# EAGLE board board (EAGLE 7.7.0), part 1 of 3
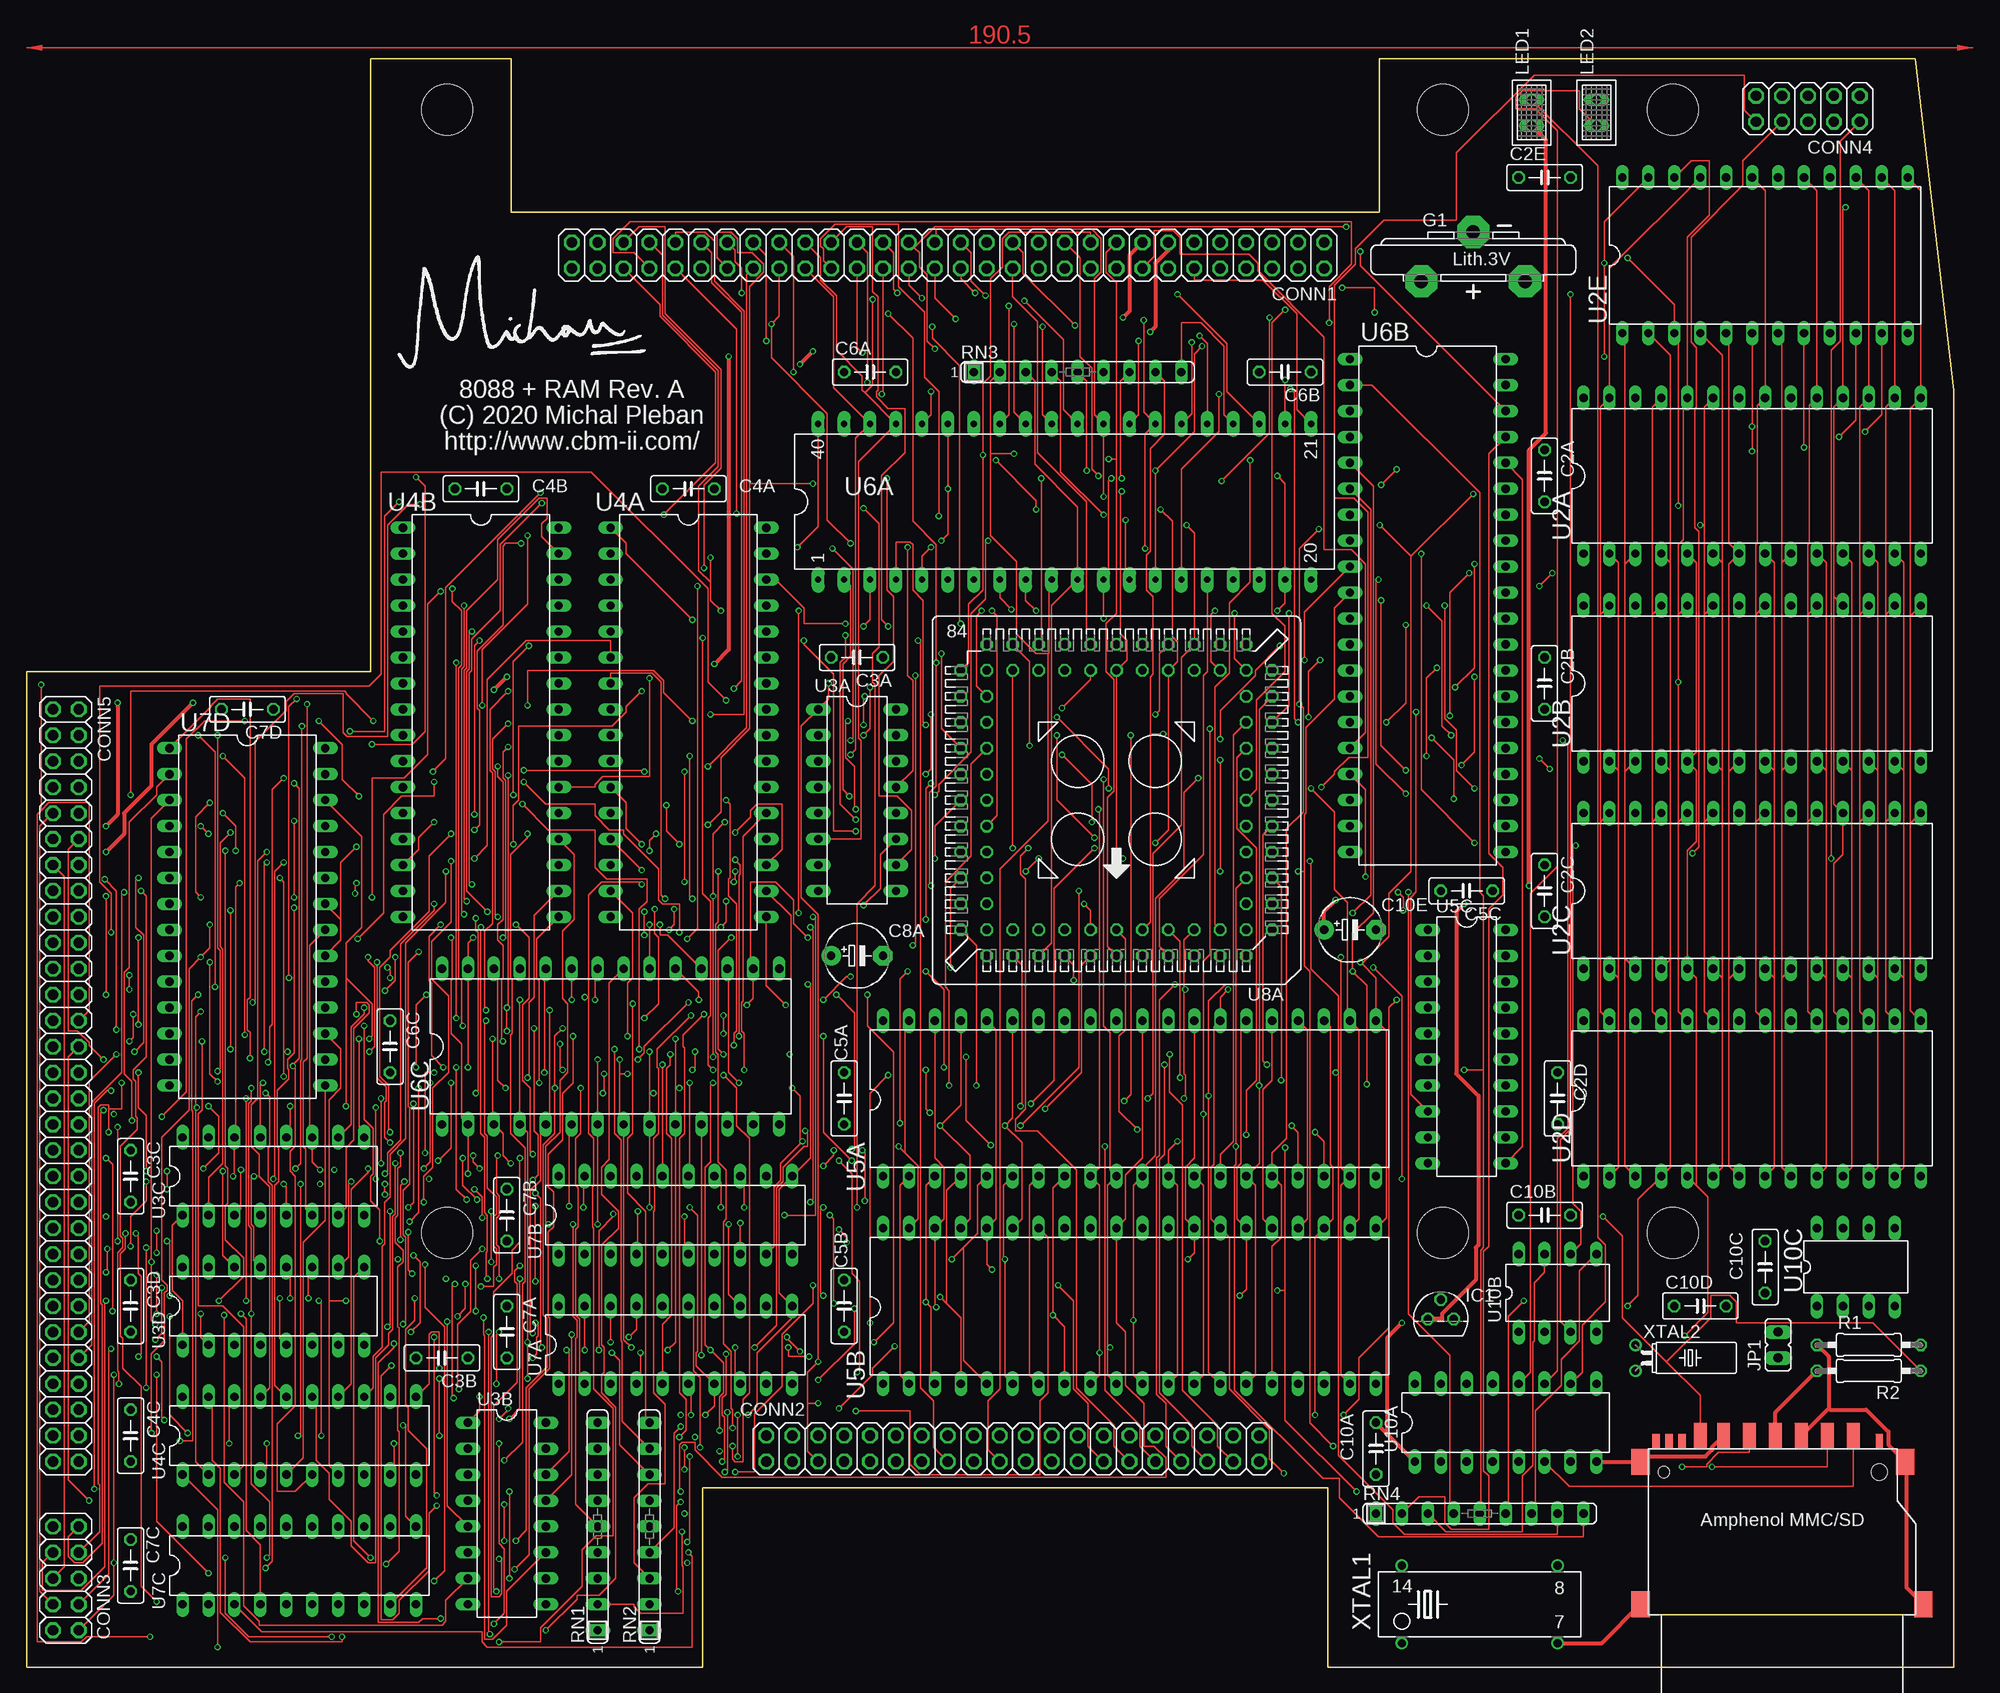
[diagram p10: board, top side]
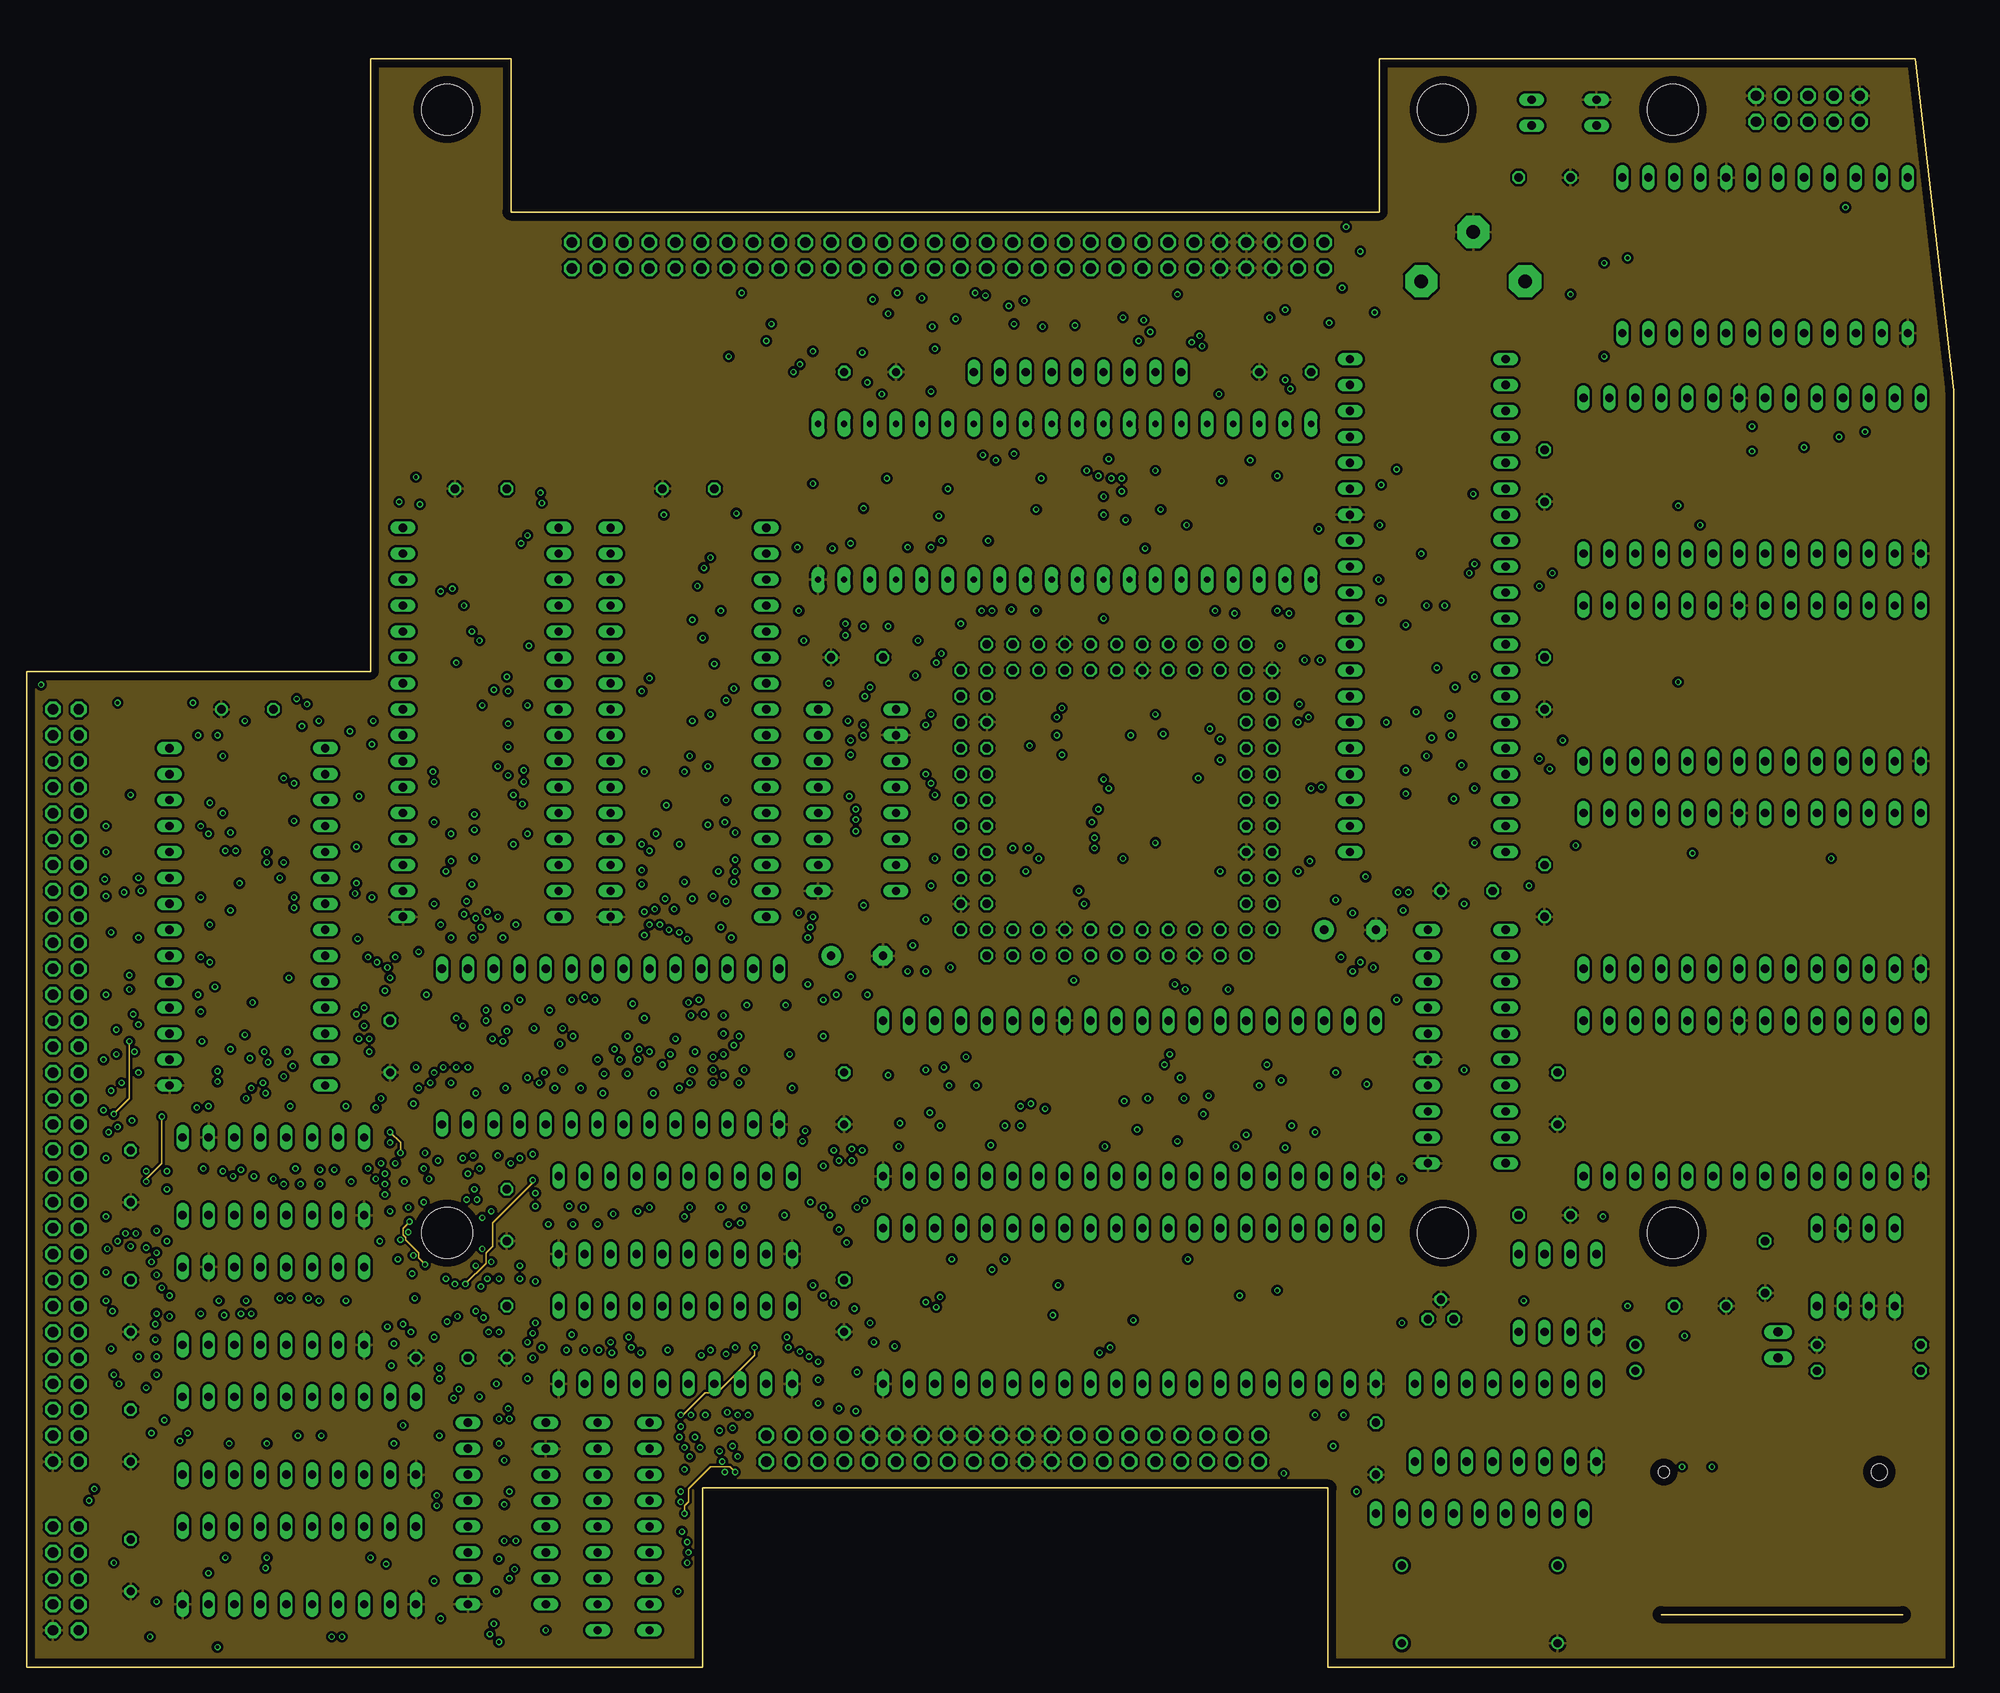
[diagram p11: board, inner layer Route2]
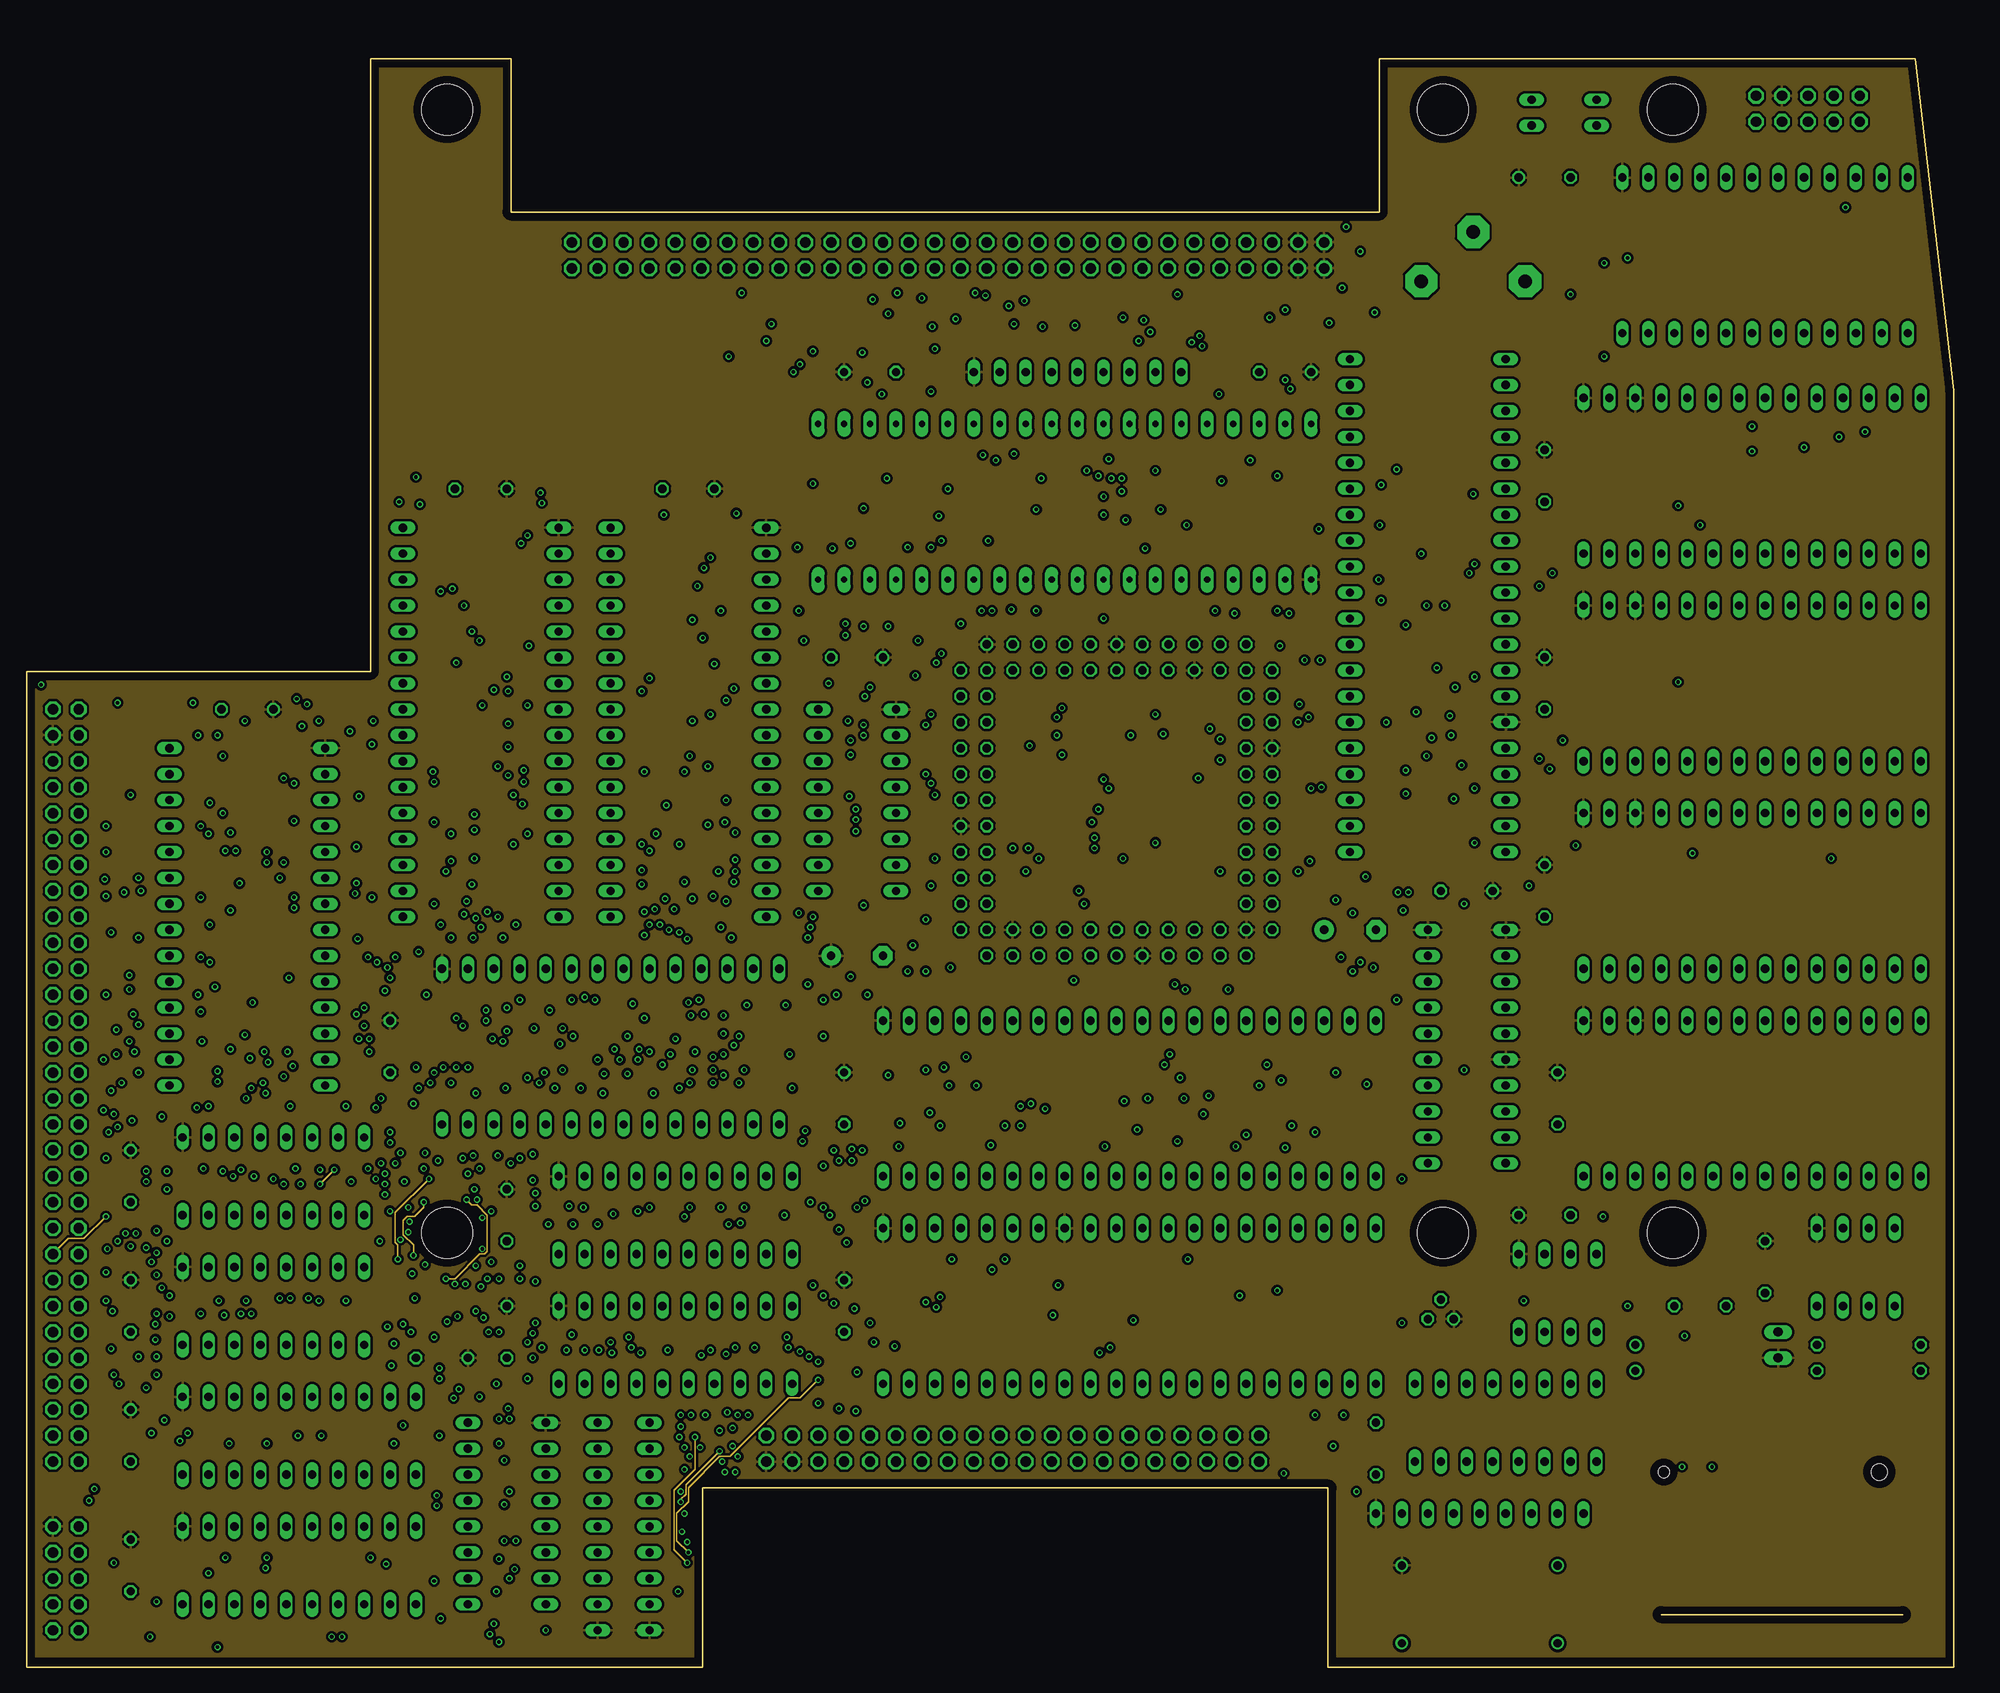
[diagram p12: board, inner layer Route15]
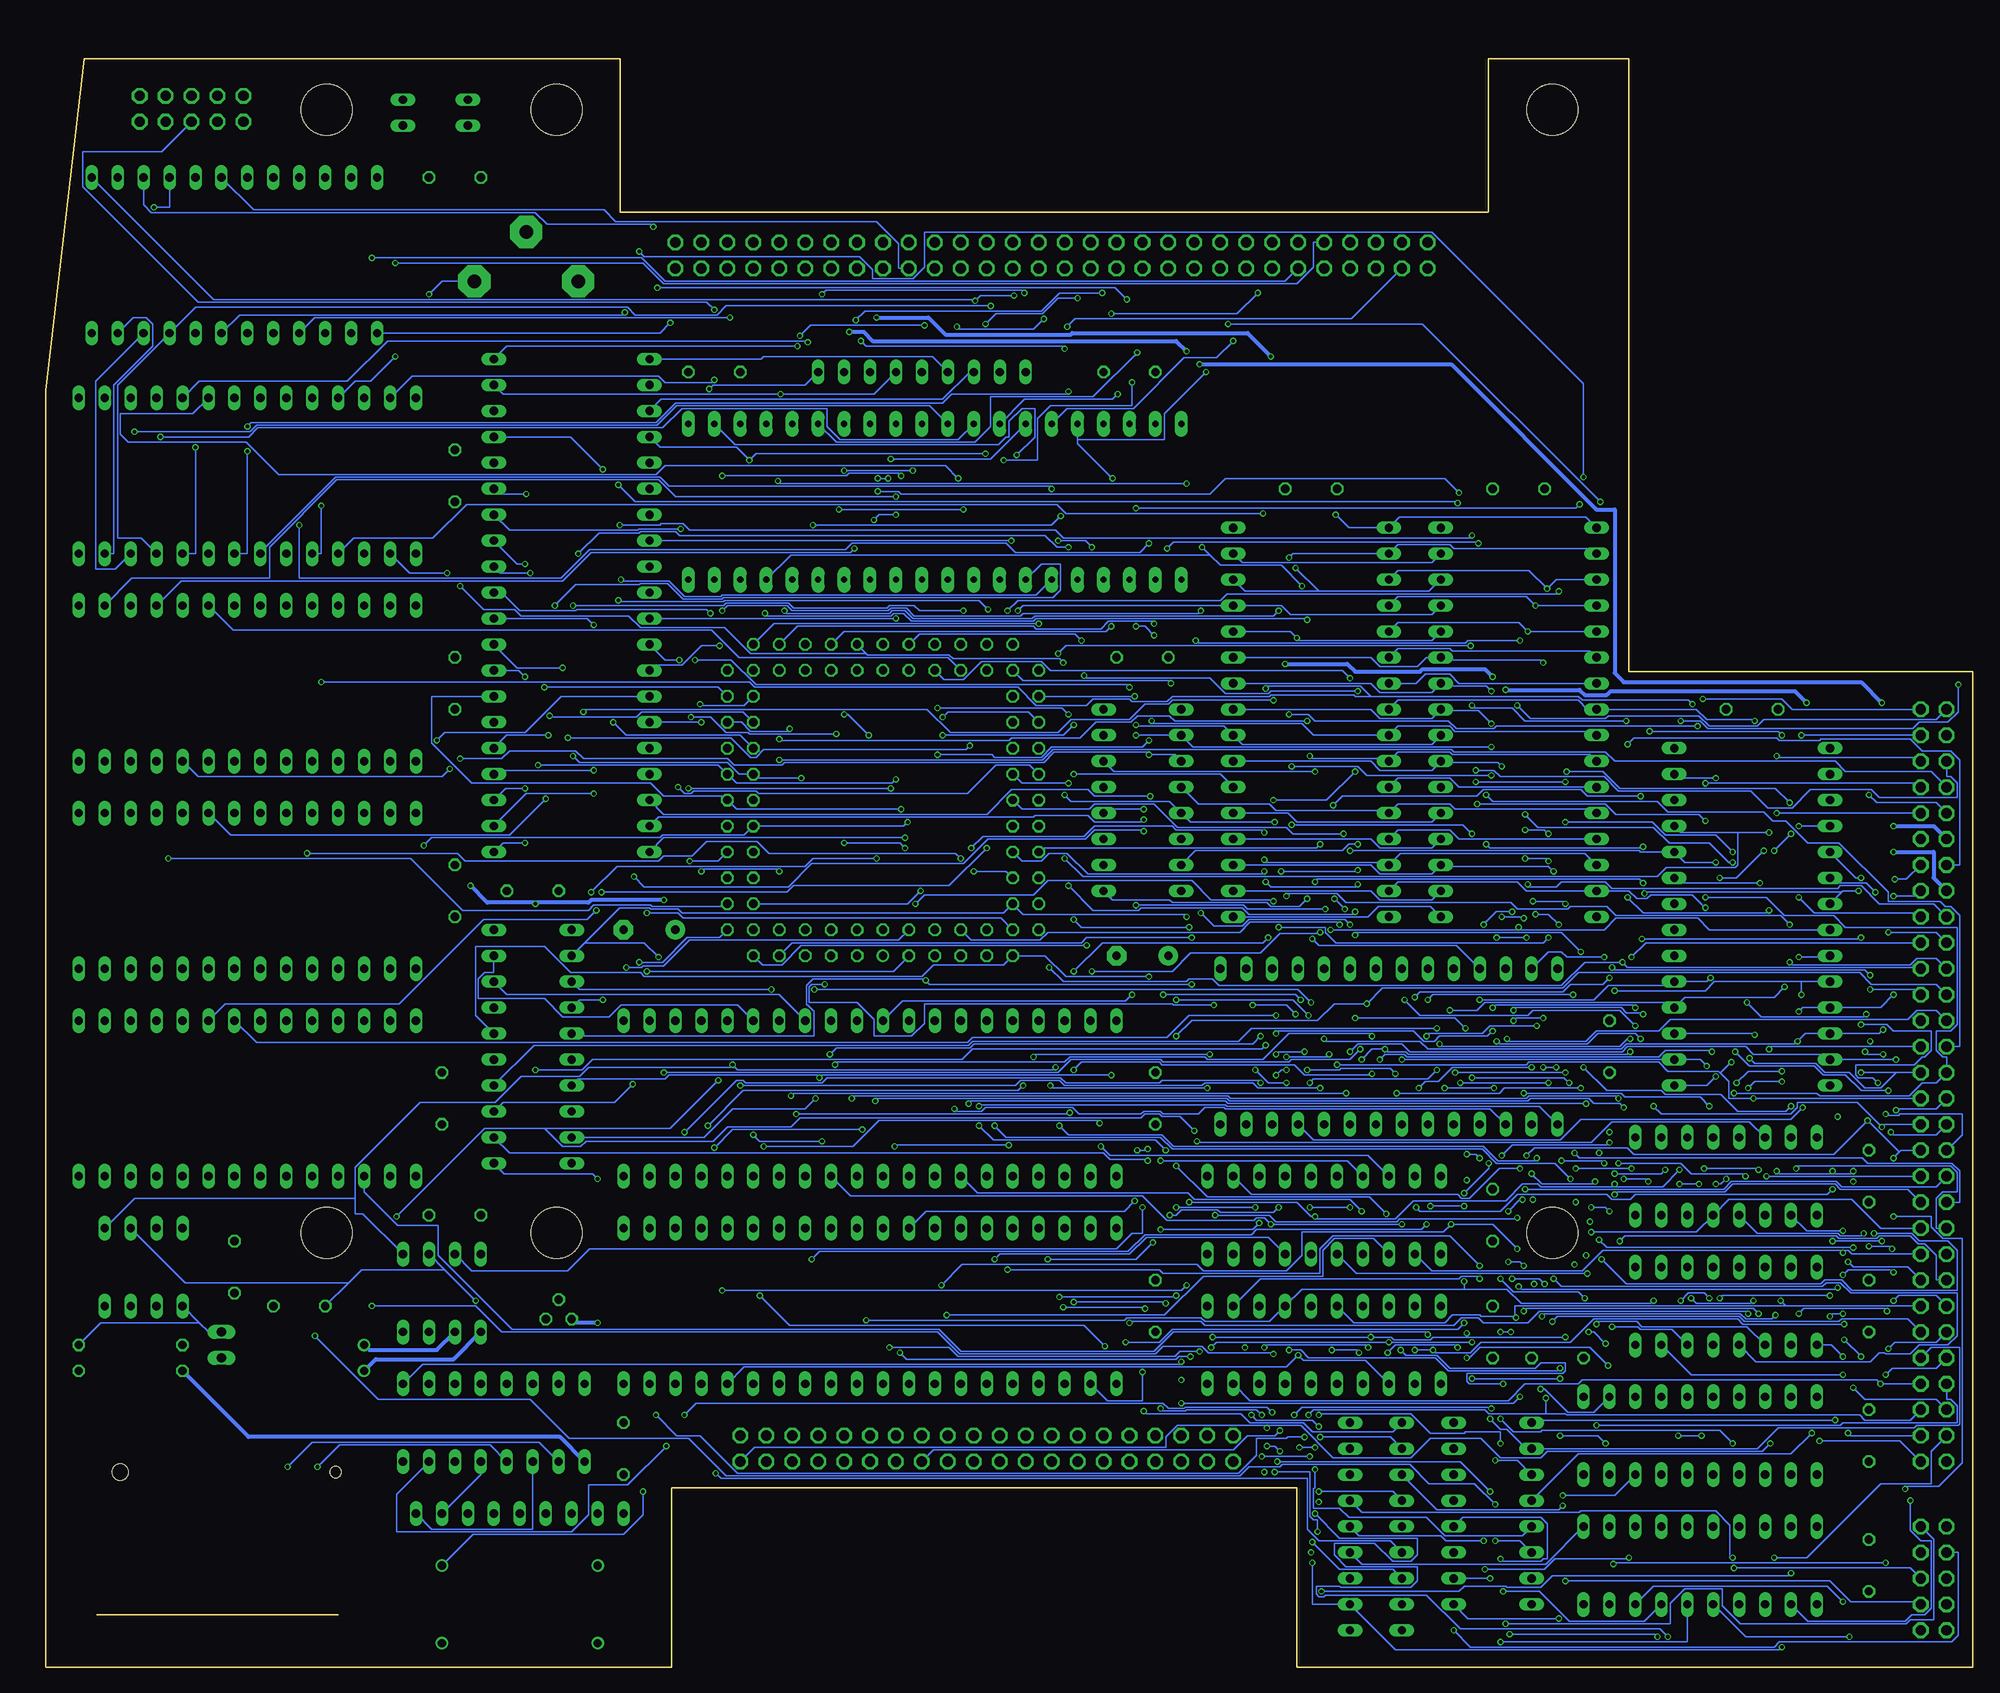
[diagram p13: board, bottom side, seen from below]

Size 188.65 x 157.5 mm. Coordinates in mm from the lower left corner, seen from the top.
Outline: 0,0 0,97.5 33.65,97.5 33.65,157.5 47.4,157.5 47.4,142.46 132.4,142.46 132.4,157.5 184.9,157.5 188.65,125 188.65,0 127.4,0 127.4,17.54 66.15,17.54 66.15,0 0,0
Copper layers (1+2*15+16): Top 0.035mm / dielectric 0.5mm / Route2 0.035mm / dielectric 0.5mm / Route15 0.035mm / dielectric 0.5mm / Bottom 0.035mm
Design rules "default *": minimum track width 5mil, minimum drill 0.35mm, track to track 5mil, track to pad 5mil, pad to pad 10mil, via to via 15mil, smd to smd 5mil, copper to edge 30mil, drill to drill 5mil, minimum pad ring 5mil, minimum via ring 5mil, stop-mask expansion 5mil, vias tented up to drill 0mil, thermal gap 10mil
Net classes: 0 default: width 0.127 mm, drill 0.127 mm, clearance 0.127 mm; 1 power: width 0.381 mm, drill 0.254 mm, clearance 0.254 mm to class 0, clearance 0.254 mm
Holes 5 mm at 41.15,42.5 41.15,152.5 161.15,152.5 138.65,152.5 138.65,42.5 161.15,42.5
tRestrict: area 52.7,130.2 to 52.8,130.2; area 34.3,117.9 to 50.8,139.5; area 38.1,117.9 to 67.3,126.8; area 50.8,126.8 to 61,133.2

## Footprints (pad centres in the part's own frame; a part is rotated, then mirrored left to right if it is on the bottom)
C050-025X075 = drill 0.813 octagon: 1 -2.54,0; 2 2.54,0
E5-6 = drill 0.813 pad 1.905: + -2.54,0 | drill 0.813 pad 1.905 octagon: - 2.54,0
2X30 = drill 1.016 octagon: 1 -38.1,-1.27; 2 -38.1,1.27; 3 -35.56,-1.27; 4 -35.56,1.27; 5 -33.02,-1.27; 6 -33.02,1.27; 7 -30.48,-1.27; 8 -30.48,1.27; 9 -27.94,-1.27; 10 -27.94,1.27; 11 -25.4,-1.27; 12 -25.4,1.27; 13 -22.86,-1.27; 14 -22.86,1.27; 15 -20.32,-1.27; 16 -20.32,1.27; 17 -17.78,-1.27; 18 -17.78,1.27; 19 -15.24,-1.27; 20 -15.24,1.27; 21 -12.7,-1.27; 22 -12.7,1.27; 23 -10.16,-1.27; 24 -10.16,1.27; 25 -7.62,-1.27; 26 -7.62,1.27; 27 -5.08,-1.27; 28 -5.08,1.27; 29 -2.54,-1.27; 30 -2.54,1.27; 31 0,-1.27; 32 0,1.27; 33 2.54,-1.27; 34 2.54,1.27; 35 5.08,-1.27; 36 5.08,1.27; 37 7.62,-1.27; 38 7.62,1.27; 39 10.16,-1.27; 40 10.16,1.27; 41 12.7,-1.27; 42 12.7,1.27; 43 15.24,-1.27; 44 15.24,1.27; 45 17.78,-1.27; 46 17.78,1.27; 47 20.32,-1.27; 48 20.32,1.27; 49 22.86,-1.27; 50 22.86,1.27; 51 25.4,-1.27; 52 25.4,1.27; 53 27.94,-1.27; 54 27.94,1.27; 55 30.48,-1.27; 56 30.48,1.27; 57 33.02,-1.27; 58 33.02,1.27; 59 35.56,-1.27; 60 35.56,1.27
2X20 = drill 1.016 octagon: 1 -24.13,-1.27; 2 -24.13,1.27; 3 -21.59,-1.27; 4 -21.59,1.27; 5 -19.05,-1.27; 6 -19.05,1.27; 7 -16.51,-1.27; 8 -16.51,1.27; 9 -13.97,-1.27; 10 -13.97,1.27; 11 -11.43,-1.27; 12 -11.43,1.27; 13 -8.89,-1.27; 14 -8.89,1.27; 15 -6.35,-1.27; 16 -6.35,1.27; 17 -3.81,-1.27; 18 -3.81,1.27; 19 -1.27,-1.27; 20 -1.27,1.27; 21 1.27,-1.27; 22 1.27,1.27; 23 3.81,-1.27; 24 3.81,1.27; 25 6.35,-1.27; 26 6.35,1.27; 27 8.89,-1.27; 28 8.89,1.27; 29 11.43,-1.27; 30 11.43,1.27; 31 13.97,-1.27; 32 13.97,1.27; 33 16.51,-1.27; 34 16.51,1.27; 35 19.05,-1.27; 36 19.05,1.27; 37 21.59,-1.27; 38 21.59,1.27; 39 24.13,-1.27; 40 24.13,1.27
2X05 = drill 1.016 octagon: 1 -5.08,-1.27; 2 -5.08,1.27; 3 -2.54,-1.27; 4 -2.54,1.27; 5 0,-1.27; 6 0,1.27; 7 2.54,-1.27; 8 2.54,1.27; 9 5.08,-1.27; 10 5.08,1.27
CR2032V = drill 1.321 pad 3.15 octagon: + -2.54,-5.08; +@1 -2.54,5.08; - 2.286,0
TO92 = drill 0.813 octagon: 1 -1.27,0; 2 0,1.905; 3 1.27,0
SDCMF-10915W010 = smd 1.27 x 2.54: 1 7.366,13.97; 2 4.826,13.97; 3 2.286,13.97; 4 -0.254,13.97; 5 -2.794,13.97; 6 -5.334,13.97; 7 -7.62,13.97 | smd 0.711 x 1.422: 8 -9.398,13.462; 9 9.906,13.462; 10 -11.938,13.462; 11 -10.668,13.462 | smd 1.778 x 2.54: M1 12.446,11.43; M2 14.224,-2.54; M3 -13.462,-2.54; M4 -13.462,11.43 | hole 1.6: 9.906,10.414 | hole 1.1: -11.176,10.414
JP1 = drill 0.914 long: 1 0,-1.27; 2 0,1.27
U57X32 = drill 0.813 long: A -1.27,0; K 1.27,0
0207/10 = drill 0.813 octagon: 1 -5.08,0; 2 5.08,0
SIL9 = drill 0.813 long: 1 -10.16,0; 2 -7.62,0; 3 -5.08,0; 4 -2.54,0; 5 0,0; 6 2.54,0; 7 5.08,0; 8 7.62,0; 9 10.16,0
DIL28-6 = drill 0.813 long: 1 -16.51,-7.62; 2 -13.97,-7.62; 3 -11.43,-7.62; 4 -8.89,-7.62; 5 -6.35,-7.62; 6 -3.81,-7.62; 7 -1.27,-7.62; 8 1.27,-7.62; 9 3.81,-7.62; 10 6.35,-7.62; 11 8.89,-7.62; 12 11.43,-7.62; 13 13.97,-7.62; 14 16.51,-7.62; 15 16.51,7.62; 16 13.97,7.62; 17 11.43,7.62; 18 8.89,7.62; 19 6.35,7.62; 20 3.81,7.62; 21 1.27,7.62; 22 -1.27,7.62; 23 -3.81,7.62; 24 -6.35,7.62; 25 -8.89,7.62; 26 -11.43,7.62; 27 -13.97,7.62; 28 -16.51,7.62
DIL24 = drill 0.813 long: 1 -13.97,-7.62; 2 -11.43,-7.62; 3 -8.89,-7.62; 4 -6.35,-7.62; 5 -3.81,-7.62; 6 -1.27,-7.62; 7 1.27,-7.62; 8 3.81,-7.62; 9 6.35,-7.62; 10 8.89,-7.62; 11 11.43,-7.62; 12 13.97,-7.62; 13 13.97,7.62; 14 11.43,7.62; 15 8.89,7.62; 16 6.35,7.62; 17 3.81,7.62; 18 1.27,7.62; 19 -1.27,7.62; 20 -3.81,7.62; 21 -6.35,7.62; 22 -8.89,7.62; 23 -11.43,7.62; 24 -13.97,7.62
DIL16 = drill 0.813 long: 1 -8.89,-3.81; 2 -6.35,-3.81; 3 -3.81,-3.81; 4 -1.27,-3.81; 5 1.27,-3.81; 6 3.81,-3.81; 7 6.35,-3.81; 8 8.89,-3.81; 9 8.89,3.81; 10 6.35,3.81; 11 3.81,3.81; 12 1.27,3.81; 13 -1.27,3.81; 14 -3.81,3.81; 15 -6.35,3.81; 16 -8.89,3.81
DIL32 = drill 0.813 long: 1 -17.78,-7.62; 2 -15.24,-7.62; 3 -12.7,-7.62; 4 -10.16,-7.62; 5 -7.62,-7.62; 6 -5.08,-7.62; 7 -2.54,-7.62; 8 0,-7.62; 9 2.54,-7.62; 10 5.08,-7.62; 11 7.62,-7.62; 12 10.16,-7.62; 13 12.7,-7.62; 14 15.24,-7.62; 15 17.78,-7.62; 16 20.32,-7.62; 17 20.32,7.62; 18 17.78,7.62; 19 15.24,7.62; 20 12.7,7.62; 21 10.16,7.62; 22 7.62,7.62; 23 5.08,7.62; 24 2.54,7.62; 25 0,7.62; 26 -2.54,7.62; 27 -5.08,7.62; 28 -7.62,7.62; 29 -10.16,7.62; 30 -12.7,7.62; 31 -15.24,7.62; 32 -17.78,7.62
DIL20 = drill 0.813 long: 1 -11.43,-3.81; 2 -8.89,-3.81; 3 -6.35,-3.81; 4 -3.81,-3.81; 5 -1.27,-3.81; 6 1.27,-3.81; 7 3.81,-3.81; 8 6.35,-3.81; 9 8.89,-3.81; 10 11.43,-3.81; 11 11.43,3.81; 12 8.89,3.81; 13 6.35,3.81; 14 3.81,3.81; 15 1.27,3.81; 16 -1.27,3.81; 17 -3.81,3.81; 18 -6.35,3.81; 19 -8.89,3.81; 20 -11.43,3.81
DIL40 = drill 0.813 long: 1 -24.13,-7.62; 2 -21.59,-7.62; 3 -19.05,-7.62; 4 -16.51,-7.62; 5 -13.97,-7.62; 6 -11.43,-7.62; 7 -8.89,-7.62; 8 -6.35,-7.62; 9 -3.81,-7.62; 10 -1.27,-7.62; 11 1.27,-7.62; 12 3.81,-7.62; 13 6.35,-7.62; 14 8.89,-7.62; 15 11.43,-7.62; 16 13.97,-7.62; 17 16.51,-7.62; 18 19.05,-7.62; 19 21.59,-7.62; 20 24.13,-7.62; 21 24.13,7.62; 22 21.59,7.62; 23 19.05,7.62; 24 16.51,7.62; 25 13.97,7.62; 26 11.43,7.62; 27 8.89,7.62; 28 6.35,7.62; 29 3.81,7.62; 30 1.27,7.62; 31 -1.27,7.62; 32 -3.81,7.62; 33 -6.35,7.62; 34 -8.89,7.62; 35 -11.43,7.62; 36 -13.97,7.62; 37 -16.51,7.62; 38 -19.05,7.62; 39 -21.59,7.62; 40 -24.13,7.62
DIP40 = drill 0.61 pad 1.27 long: 1 -24.13,-7.62; 2 -21.59,-7.62; 3 -19.05,-7.62; 4 -16.51,-7.62; 5 -13.97,-7.62; 6 -11.43,-7.62; 7 -8.89,-7.62; 8 -6.35,-7.62; 9 -3.81,-7.62; 10 -1.27,-7.62; 11 1.27,-7.62; 12 3.81,-7.62; 13 6.35,-7.62; 14 8.89,-7.62; 15 11.43,-7.62; 16 13.97,-7.62; 17 16.51,-7.62; 18 19.05,-7.62; 19 21.59,-7.62; 20 24.13,-7.62; 21 24.13,7.62; 22 21.59,7.62; 23 19.05,7.62; 24 16.51,7.62; 25 13.97,7.62; 26 11.43,7.62; 27 8.89,7.62; 28 6.35,7.62; 29 3.81,7.62; 30 1.27,7.62; 31 -1.27,7.62; 32 -3.81,7.62; 33 -6.35,7.62; 34 -8.89,7.62; 35 -11.43,7.62; 36 -13.97,7.62; 37 -16.51,7.62; 38 -19.05,7.62; 39 -21.59,7.62; 40 -24.13,7.62
DIL28 = drill 0.813 long: 1 -16.51,-7.62; 2 -13.97,-7.62; 3 -11.43,-7.62; 4 -8.89,-7.62; 5 -6.35,-7.62; 6 -3.81,-7.62; 7 -1.27,-7.62; 8 1.27,-7.62; 9 3.81,-7.62; 10 6.35,-7.62; 11 8.89,-7.62; 12 11.43,-7.62; 13 13.97,-7.62; 14 16.51,-7.62; 15 16.51,7.62; 16 13.97,7.62; 17 11.43,7.62; 18 8.89,7.62; 19 6.35,7.62; 20 3.81,7.62; 21 1.27,7.62; 22 -1.27,7.62; 23 -3.81,7.62; 24 -6.35,7.62; 25 -8.89,7.62; 26 -11.43,7.62; 27 -13.97,7.62; 28 -16.51,7.62
S84 = drill 0.813: 1 0,15.24 | drill 0.813 octagon: 2 0,12.7; 3 -2.54,15.24; 4 -2.54,12.7; 5 -5.08,15.24; 6 -5.08,12.7; 7 -7.62,15.24; 8 -7.62,12.7; 9 -10.16,15.24; 10 -10.16,12.7; 11 -12.7,15.24; 12 -15.24,12.7; 13 -12.7,12.7; 14 -15.24,10.16; 15 -12.7,10.16; 16 -15.24,7.62; 17 -12.7,7.62; 18 -15.24,5.08; 19 -12.7,5.08; 20 -15.24,2.54; 21 -12.7,2.54; 22 -15.24,0; 23 -12.7,0; 24 -15.24,-2.54; 25 -12.7,-2.54; 26 -15.24,-5.08; 27 -12.7,-5.08; 28 -15.24,-7.62; 29 -12.7,-7.62; 30 -15.24,-10.16; 31 -12.7,-10.16; 32 -15.24,-12.7; 33 -12.7,-15.24; 34 -12.7,-12.7; 35 -10.16,-15.24; 36 -10.16,-12.7; 37 -7.62,-15.24; 38 -7.62,-12.7; 39 -5.08,-15.24; 40 -5.08,-12.7; 41 -2.54,-15.24; 42 -2.54,-12.7; 43 0,-15.24; 44 0,-12.7; 45 2.54,-15.24; 46 2.54,-12.7; 47 5.08,-15.24; 48 5.08,-12.7; 49 7.62,-15.24; 50 7.62,-12.7; 51 10.16,-15.24; 52 10.16,-12.7; 53 12.7,-15.24; 54 15.24,-12.7; 55 12.7,-12.7; 56 15.24,-10.16; 57 12.7,-10.16; 58 15.24,-7.62; 59 12.7,-7.62; 60 15.24,-5.08; 61 12.7,-5.08; 62 15.24,-2.54; 63 12.7,-2.54; 64 15.24,0; 65 12.7,0; 66 15.24,2.54; 67 12.7,2.54; 68 15.24,5.08; 69 12.7,5.08; 70 15.24,7.62; 71 12.7,7.62; 72 15.24,10.16; 73 12.7,10.16; 74 15.24,12.7; 75 12.7,15.24; 76 12.7,12.7; 77 10.16,15.24; 78 10.16,12.7; 79 7.62,15.24; 80 7.62,12.7; 81 5.08,15.24; 82 5.08,12.7; 83 2.54,15.24; 84 2.54,12.7
DIL08 = drill 0.813 long: 1 -3.81,-3.81; 2 -1.27,-3.81; 3 1.27,-3.81; 4 3.81,-3.81; 5 3.81,3.81; 6 1.27,3.81; 7 -1.27,3.81; 8 -3.81,3.81
DIL8 = drill 0.813 long: 1 -3.81,-3.81; 2 -1.27,-3.81; 3 1.27,-3.81; 4 3.81,-3.81; 5 3.81,3.81; 6 1.27,3.81; 7 -1.27,3.81; 8 -3.81,3.81
SG51 = drill 0.813: 1 -7.62,-3.81; 7 7.62,-3.81; 8 7.62,3.81; 14 -7.62,3.81
TC38H = drill 0.813: 1 -1.27,0; 2 1.27,0

## Placement (x,y rotation side)
C2A  100n  [C050-025X075]  148.59,116.64 270 top
C2B  100n  [C050-025X075]  148.59,96.32 270 top
C2C  100n  [C050-025X075]  148.59,76 270 top
C2D  100n  [C050-025X075]  149.86,55.68 270 top
C2E  100n  [C050-025X075]  148.59,145.85 0 top
C3A  100n  [C050-025X075]  81.28,98.86 180 top
C3B  100n  [C050-025X075]  40.64,30.28 180 top
C3C  100n  [C050-025X075]  10.16,48.06 270 top
C3D  100n  [C050-025X075]  10.16,35.36 270 top
C4A  100n  [C050-025X075]  64.77,115.37 180 top
C4B  100n  [C050-025X075]  44.45,115.37 180 top
C4C  100n  [C050-025X075]  10.16,22.66 270 top
C5A  100n  [C050-025X075]  80.01,55.68 270 top
C5B  100n  [C050-025X075]  80.01,35.36 270 top
C5C  100n  [C050-025X075]  140.97,76 180 top
C6A  100n  [C050-025X075]  82.55,126.8 0 top
C6B  100n  [C050-025X075]  123.19,126.8 180 top
C6C  100n  [C050-025X075]  35.56,60.76 270 top
C7A  100n  [C050-025X075]  46.99,32.82 270 top
C7B  100n  [C050-025X075]  46.99,44.25 270 top
C7C  100n  [C050-025X075]  10.16,9.96 270 top
C7D  100n  [C050-025X075]  21.59,93.78 180 top
C8A  25u  [E5-6]  81.28,69.65 0 top
C10A  100n  [C050-025X075]  132.08,21.39 270 top
C10B  100n  [C050-025X075]  148.59,44.25 0 top
C10C  100n  [C050-025X075]  170.18,39.17 270 top
C10D  100n  [C050-025X075]  163.83,35.36 0 top
C10E  25u  [E5-6]  129.54,72.19 0 top
CONN1  MAINBOARD  [2X30]  88.9,138.23 180 top
CONN2  DRAM  [2X20]  96.52,21.39 180 top
CONN3  I/O  [2X05]  3.81,8.69 270 top
CONN4  JTAG  [2X05]  174.37,152.58 180 top
CONN5  ISA  [2X30]  3.81,55.68 270 top
G1  CR2032V  [CR2032V]  141.61,138.23 90 top
IC1  LP2950Z  [TO92]  138.43,34.09 0 top
J1  [SDCMF-10915W010]  171.45,8.69 0 top
JP1  [JP1]  171.45,31.55 0 top
LED1  [U57X32]  147.32,152.2 90 top
LED2  [U57X32]  153.67,152.2 90 top
R1  4.7k  [0207/10]  180.34,31.55 0 top
R2  4.7k  [0207/10]  180.34,29.01 180 top
RN1  [SIL9]  55.88,13.77 90 top
RN2  [SIL9]  60.96,13.77 90 top
RN3  [SIL9]  102.87,126.8 0 top
RN4  [SIL9]  142.24,15.04 0 top
U2A  [DIL28-6]  168.91,116.64 0 top
U2B  [DIL28-6]  168.91,96.32 0 top
U2C  [DIL28-6]  168.91,76 0 top
U2D  [DIL28-6]  168.91,55.68 0 top
U2E  6116  [DIL24]  170.18,138.23 0 top
U3A  74LS257N  [DIL16]  81.28,84.89 270 top
U3B  74LS257N  [DIL16]  46.99,15.04 270 top
U3C  74LS257N  [DIL16]  24.13,48.06 0 top
U3D  74LS257N  [DIL16]  24.13,35.36 0 top
U4A  HM628512A_DIL32  [DIL32]  64.77,93.78 270 top
U4B  HM628512A_DIL32  [DIL32]  44.45,93.78 270 top
U4C  74LS245N  [DIL20]  26.67,22.66 0 top
U5A  8088MAX  [DIL40]  107.95,55.68 0 top
U5B  8087  [DIL40]  107.95,35.36 0 top
U5C  8288-A  [DIL20]  140.97,60.76 270 top
U6A  6526  [DIP40]  101.6,114.1 0 top
U6B  8255  [DIL40]  137.16,103.94 270 top
U6C  8259  [DIL28-6]  57.15,60.76 0 top
U7A  74LS373N  [DIL20]  63.5,31.55 0 top
U7B  74LS373N  [DIL20]  63.5,44.25 0 top
U7C  74HC373N  [DIL20]  26.67,9.96 0 top
U7D  27512  [DIL28]  21.59,73.46 270 top
U8A  ATF1508-JU84  [S84]  106.68,84.89 180 top
U10A  4050N  [DIL16]  144.78,23.93 0 top
U10B  DS1307  [DIL08]  149.86,36.63 0 top
U10C  24C64P  [DIL8]  179.07,39.17 0 top
XTAL1  24MHz  [SG51]  142.24,6.15 0 top
XTAL2  [TC38H]  157.48,30.28 270 top

## Tracks (layer width: path | path; a pad name or v marks a point on that pad's centre or on a via)
+3V3  (via drill 0.35)
  Top 0.381: R2.2 171.2,24.95 J1.4 | U10A.1 133.1,22.91 | 133.1,22.91 C10A.1 | v134.62,33.71 133.22,32.31 133.22,23.04 133.1,22.91 | LED1.A 148.72,149.53 148.72,120.83 147.07,119.18 v147.07,76.51 | v128.14,75.11 127,73.97 C10E.+ | IC1.1 138.56,34.09 138.56,34.6 141.86,37.9 141.86,41.08 142.11,41.33 142.11,55.93 139.95,58.09 139.95,73.97 v140.72,74.73
  Bottom 0.381: IC1.1 136.78,33.71 v134.62,33.71 | R2.2 168.78,22.53 138.3,22.53 U10A.1 | v147.07,76.51 145.41,74.86 140.72,74.86 | 140.72,74.86 135.51,74.86 135.25,75.11 v128.14,75.11 | v140.72,74.73 140.72,74.86
+12V  (via drill 0.35)
  Top 0.381: v7.75,79.81 9.53,81.59 9.53,83.62 12.19,86.29 12.19,90.35 v16.26,94.42 | v46.99,96.95 v45.72,95.69 | v67.31,98.22 68.71,99.62 v68.71,128.32 | v107.32,132.13 107.95,132.77 107.95,138.23 CONN1.15
  Bottom 0.381: CONN5.15 3.81,77.27 3.81,79.81 v7.75,79.81 | v16.26,94.42 17.4,95.56 35.43,95.56 35.81,95.18 37.97,95.18 38.48,95.69 v45.72,95.69 | v46.99,96.95 47.75,97.72 53.85,97.72 54.1,97.46 60.45,97.46 61.21,98.22 v67.31,98.22 | v68.71,128.32 70.99,130.61 88.14,130.61 88.27,130.48 100.58,130.48 102.23,132.13 v107.32,132.13
-12V  (via drill 0.35)
  Top 0.381: v7.75,82.35 8.89,83.49 v8.89,94.42 | v76.96,128.83 v75.69,127.56 | v109.98,130.74 110.49,131.25 110.49,137.47 111.76,138.74 CONN1.13
  Bottom 0.381: CONN5.11 3.81,82.35 v7.75,82.35 | v8.89,94.42 10.92,96.45 34.16,96.45 35.05,97.34 35.05,113.34 36.83,113.34 51.05,127.56 v75.69,127.56 | v76.96,128.83 77.98,129.85 107.7,129.85 108.59,130.74 v109.98,130.74
/AIOWC  (via drill 0.35)
  Top 0.127: RN2.9 60.58,24.31 60.58,44.63 58.8,46.41 58.8,51.74 59.31,52.25 v59.31,64.95 | v80.77,49.58 77.98,52.38 v77.98,61.78
  Bottom 0.127: CONN5.23 3.56,66.86 9.91,66.86 11.05,68 38.61,68 40.13,66.47 57.79,66.47 v59.31,64.95 62.48,64.95 64.14,63.3 76.45,63.3 v77.98,61.78 | U5C.12 143.26,50.35 85.09,50.35 84.46,49.71 80.9,49.71 v80.77,49.58
/AMWC  (via drill 0.35)
  Top 0.127: U5C.8 135.51,56.06 135.51,75.37 136.02,75.87 v136.02,93.53 | v68.45,94.67 66.68,96.45 66.68,105.59 55.24,117.02 34.67,117.02 34.67,97.21 33.53,96.07 7.11,96.07 7.11,76.89 8.26,75.75 v8.26,71.94
  Bottom 0.127: v136.02,93.53 135.76,93.78 102.36,93.78 100.08,91.49 89.54,91.49 88.27,92.76 82.55,92.76 81.03,94.29 78.74,94.29 78.36,94.67 v68.45,94.67 | v8.26,71.94 3.56,71.94 CONN5.19
/BUSY1  (via drill 0.35)
  Top 0.127: U8A.10 116.33,72.7 116.33,95.94 117.73,97.34 117.73,104.19 119.76,106.23 v119.76,118.16 | RN3.2 94.36,125.91 94.36,118.8 | 94.36,118.8 94.36,110.8 96.9,108.26 96.9,101.15 98.81,99.24 99.95,99.24 | 99.95,99.24 100.08,99.24 100.08,106.23 U6A.10 | CONN2.22 94.11,21.26 94.11,26.09 95.25,27.23 95.25,78.16 99.95,82.86 99.95,99.24 | 94.36,118.8 v96.65,118.8
  Bottom 0.127: U6B.4 128.52,119.43 121.03,119.43 v119.76,118.16 119.13,118.8 v96.65,118.8
/BUSY2  (via drill 0.35)
  Top 0.127: v13.46,24.18 13.21,24.44 13.21,29.9 v12.7,30.41 | U3C.1 14.22,43.23 14.22,36.88 15.24,35.87 U3D.1 | v78.49,96.32 78.49,94.8 U3A.1 75.82,92.13 75.82,75.37 77.47,73.71 v77.47,29.9 76.45,28.88 76.45,25.84 | 76.45,25.84 76.45,21.14 CONN2.36 | U3B.1 44.32,25.07 v44.32,26.47 | 76.45,25.84 v77.47,25.84
  Bottom 0.127: U3B.1 42.93,24.18 v13.46,24.18 | v12.7,30.41 13.84,31.55 U3D.1 | v78.49,96.32 78.74,96.57 92.96,96.57 U8A.55 | U10A.9 151.77,29.64 77.72,29.64 v77.47,29.9 | v44.32,26.47 44.96,25.84 v77.47,25.84
/CAS  (via drill 0.35)
  Top 0.127: U8A.45 103.76,100.51 103.76,114.1 98.93,118.93 98.93,131.75 96.52,134.17 CONN1.26 | CONN2.26 88.77,21.52 88.77,26.09 87.5,27.36 87.5,100.26 v87.25,100.51
  Bottom 0.127: v87.25,100.51 87.88,101.15 103.12,101.15 U8A.45
/CS_8255  (via drill 0.35)
  Top 0.127: v129.79,73.84 131.57,75.62 131.57,113.34 U6B.6
  Bottom 0.127: U8A.76 95.12,73.33 126.24,73.33 126.75,73.84 v129.79,73.84
/CS_8259  (via drill 0.35)
  Top 0.127: v97.28,54.92 97.41,55.05 97.41,68.76 U8A.77
  Bottom 0.127: U6C.1 42.42,54.92 73.03,54.92 73.15,55.05 97.16,55.05 v97.28,54.92
/EPROM  (via drill 0.35)
  Top 0.127: U7D.20 30.73,71.17 30.73,73.21 | U7D.22 30.73,73.21 | v86.74,70.67 87,70.92 v87,97.08 | v60.2,95.56 58.67,94.03 58.67,93.53 57.28,92.13 48.13,92.13 48.13,84.89 47.62,84.38 v47.62,80.57 | v32.26,80.32 30.73,78.79 30.73,73.21
  Bottom 0.127: U8A.11 118.49,68.76 116.59,68.76 114.68,70.67 v86.74,70.67 | v87,97.08 86.74,96.83 74.68,96.83 73.15,95.3 68.96,95.3 68.71,95.56 v60.2,95.56 | v47.62,80.57 47.24,80.19 32.38,80.19 v32.26,80.32
/EPROM1  (via drill 0.35)
  Top 0.127: U8A.49 99.31,100.38 v99.31,116.39
  Bottom 0.127: v99.31,116.39 100.58,117.66 128.02,117.66 128.91,116.77 165.86,116.77 169.04,119.94 180.59,119.94 181.36,120.7 181.36,122.74 174.24,122.74 U2A.20
/EPROM2
  Bottom 0.127: U8A.50 100.33,98.86 120.78,98.86 123.44,101.53 170.31,101.53 U2B.20
/EPROM3  (via drill 0.35)
  Top 0.127: U8A.51 98.17,98.48 v98.17,90.22 | v137.54,90.99 139.7,88.83 v139.7,85.02
  Bottom 0.127: v98.17,90.22 98.55,89.84 118.36,89.84 119.13,89.08 119.63,89.08 121.54,90.99 v137.54,90.99 | v139.7,85.02 143.26,81.46 170.56,81.46 U2C.20
/EPROM4  (via drill 0.35)
  Top 0.127: v96.52,80.19 U8A.52 | v134.24,75.87 134.75,75.37 v134.75,74.09
  Bottom 0.127: v96.52,80.19 100.2,76.51 115.44,76.51 116.08,75.87 v134.24,75.87 | v134.75,74.09 135.64,73.21 145.8,73.21 154.05,64.95 171.07,64.95 U2D.20
/EXTBUFCS
  Bottom 0.127: U2E.18 168.28,142.68 133.99,142.68 132.84,141.53 107.32,141.53 105.16,139.37 105.16,136.96 CONN1.20
/EXTPRTCS  (via drill 0.35)
  Top 0.127: U6A.23 117.48,124.89 117.48,129.59 v112.65,134.42 | v92.84,134.55 91.44,135.94 CONN1.30
  Bottom 0.127: v112.65,134.42 112.27,134.8 93.09,134.8 v92.84,134.55
/G  (via drill 0.35)
  Top 0.127: U4C.19 18.16,26.09 18.16,20.25 18.92,19.48 18.92,5.39 21.84,2.47 30.86,2.47 v30.86,2.97 | v45.34,3.23 45.21,3.36 v45.21,32.82 | v46.23,32.82 45.97,32.57 v45.97,27.74 | v56.01,31.04 56.01,42.73 57.4,44.12 v57.4,44.38 | v77.98,49.08 78.99,50.09 v78.99,50.6 | v97.28,53.01 103,58.73 v103,76
  Bottom 0.127: v30.86,2.97 31.12,3.23 v45.34,3.23 | v46.23,32.82 v45.21,32.82 | v45.97,27.74 49.28,27.74 49.53,27.99 49.53,28.76 40.13,28.76 39.88,29.01 39.88,29.77 42.29,29.77 42.8,29.26 51.18,29.26 52.45,30.53 55.5,30.53 v56.01,31.04 | v57.4,44.38 59.05,46.03 74.93,46.03 v77.98,49.08 | v78.99,50.6 80.01,51.62 95.89,51.62 v97.28,53.01 | v103,76 104.27,74.73 U8A.15
/INT0
  Top 0.127: U8A.5 110.87,70.54 110.87,75.24 115.19,79.56 115.19,97.08 115.57,97.46 U6A.16
/INTA  (via drill 0.35)
  Top 0.127: v47.88,12.37 48.89,13.39 48.89,27.36 50.93,29.39 50.93,34.09 50.55,34.47 50.55,51.11 51.69,52.25 v51.69,56.7 51.69,61.78 v52.45,62.54 | v46.86,56.7 46.1,57.46 46.1,68 U6C.26
  Bottom 0.127: RN2.5 60.07,12.88 52.07,12.88 51.56,12.37 v47.88,12.37 | v46.86,56.7 v51.69,56.7 | U5C.14 140.84,60.89 98.3,60.89 97.92,61.27 71.88,61.27 70.61,62.54 v52.45,62.54
/IORC  (via drill 0.35)
  Top 0.127: v45.59,61.52 45.59,53.27 U6C.3 46.61,52.25 46.61,50.09 v47.37,49.33 | RN2.7 58.04,21.77 58.04,30.03 v57.28,30.79 | v50.42,31.3 50.29,31.42 50.29,45.9 v49.78,46.41 | v131.19,57.08 131.19,66.73 v129.79,68.13 129.79,71.81 131.83,73.84 131.83,115.62 U6B.5 | v99.7,54.66 103.25,58.22 103.25,68.76 U8A.83
  Bottom 0.127: v45.59,61.52 45.34,61.27 37.85,61.27 36.83,62.28 30.73,62.28 29.59,63.43 6.35,63.43 5.46,64.32 3.56,64.32 CONN5.25 | v57.28,30.79 56.52,31.55 50.67,31.55 v50.42,31.3 | v49.78,46.41 47.37,48.82 v47.37,49.33 | U8A.83 105.66,68.13 v129.79,68.13 | v131.19,57.08 132.97,55.3 143.89,55.3 U5C.13 | U6C.3 47.24,54.66 73.15,54.66 73.28,54.79 75.18,54.79 75.82,54.16 79.25,54.16 79.5,54.41 81.15,54.41 81.41,54.16 87.5,54.16 88.14,54.79 96.65,54.79 97.03,54.41 99.44,54.41 v99.7,54.66
/IORDY  (via drill 0.35)
  Top 0.127: RN4.4 139.32,15.42 139.32,30.53 135.25,34.6 v135.25,75.87 | v107.32,79.17 106.68,79.81 U8A.44 107.7,98.61 107.7,100.51 107.06,101.15 107.06,114.99 v107.19,115.12 | v17.02,75.37 16.51,75.87 16.51,83.24 v17.91,84.64 | v39.75,87.68 41.02,88.95 41.02,105.72 v50.29,114.99
  Bottom 0.127: v135.25,75.87 132.72,78.41 114.3,78.41 113.54,79.17 v107.32,79.17 | CONN5.18 5.46,73.84 15.49,73.84 v17.02,75.37 | v17.91,84.64 19.3,86.03 34.54,86.03 36.2,87.68 v39.75,87.68 | v50.29,114.99 51.69,116.39 73.15,116.39 74.68,114.86 104.9,114.86 105.16,115.12 v107.19,115.12
/IOWC  (via drill 0.35)
  Top 0.127: v43.18,48.31 U6C.2 42.55,53.77 42.55,61.01 41.53,62.03 41.53,67.24 41.66,67.36 41.66,71.3 v41.53,71.43 | v36.96,47.55 36.58,47.17 v36.58,41.84 | v11.68,27.36 v11.68,41.08 | v131.83,68.51 134.62,65.71 v134.62,47.81 | U6B.36 146.43,116.26 146.43,50.98 U5C.11 | v67.95,72.44 68.45,72.95 v68.45,74.98 | v103.51,74.73 104.14,74.09 U8A.84
  Bottom 0.127: v43.18,48.31 42.16,47.3 37.21,47.3 v36.96,47.55 | v36.58,41.84 35.81,41.08 v11.68,41.08 | v11.68,27.36 10.54,26.22 3.56,26.22 CONN5.55 | U8A.84 105.16,71.17 125.6,71.17 128.14,68.63 130.18,68.63 130.3,68.51 v131.83,68.51 | v134.62,47.81 135.13,48.31 143.76,48.31 U5C.11 | v41.53,71.43 42.04,70.92 62.36,70.92 63.37,71.94 63.37,72.44 v67.95,72.44 | v68.45,74.98 68.58,75.11 74.55,75.11 76.45,77.02 90.55,77.02 91.95,75.62 102.62,75.62 v103.51,74.73
/IRQ3
  Top 0.127: U6A.21 124.33,123.12 124.33,132.51 121.03,135.82 114.3,135.82 CONN1.12
/MRDC  (via drill 0.35)
  Top 0.127: U8A.6 112.9,71.05 v112.9,57.71 | v23.49,10.72 23.75,10.98 23.75,16.18 21.97,17.96 v21.97,34.6 21.97,42.98 21.72,43.23 21.72,55.17 21.97,55.43 v21.97,56.7 | v18.67,57.33 17.91,58.09 v17.91,69.02 | v84.33,57.97 82.55,56.19 v82.55,33.71
  Bottom 0.127: U5C.7 136.53,57.59 128.02,57.59 127.64,57.97 113.16,57.97 v112.9,57.71 112.65,57.97 v84.33,57.97 | RN2.6 59.82,15.17 38.48,15.17 38.35,15.29 25.15,15.29 23.75,13.9 23.75,10.72 v23.49,10.72 | v21.97,56.7 21.34,57.33 v18.67,57.33 | v17.91,69.02 17.65,68.76 6.1,68.76 5.46,69.4 3.56,69.4 CONN5.21 | v82.55,33.71 82.42,33.84 75.57,33.84 75.18,33.45 50.8,33.45 50.04,34.22 48.39,34.22 47.88,33.71 43.56,33.71 42.42,34.85 22.23,34.85 v21.97,34.6
/MWTC  (via drill 0.35)
  Top 0.127: U8A.8 113.28,71.17 113.28,66.35 | 113.28,66.35 113.28,58.09 113.41,57.97 113.41,55.81 v113.28,55.68 | RN2.8 58.29,24.06 58.29,31.8 58.17,31.93 58.17,51.62 57.53,52.25 v57.53,60.51 | v33.53,60.25 34.04,60.76 34.04,68.51 33.4,69.14 v33.4,69.52 | v113.41,66.35 113.28,66.35 | v64.77,65.08 60.45,60.76 60.45,60.12 v59.82,59.49
  Bottom 0.127: v113.28,55.68 114.3,54.66 121.41,54.66 124.21,51.87 U5C.9 | v33.53,60.25 33.78,60 55.24,60 55.5,60.25 57.28,60.25 v57.53,60.51 58.8,60.51 v59.82,59.49 | v33.4,69.52 32,70.92 CONN5.20 | v113.41,66.35 66.04,66.35 v64.77,65.08
/OE  (via drill 0.35)
  Top 0.127: v82.04,95.05 81.92,94.92 v81.92,92.26
  Bottom 0.127: U4B.24 52.96,90.35 71.5,90.35 U4A.24 73.28,92.13 81.79,92.13 v81.92,92.26 | v82.04,95.05 U8A.56
/RAM1  (via drill 0.35)
  Top 0.127: v88.01,87.43 88.52,87.94 v88.52,93.27 | v101.35,93.91 104.14,96.7 U8A.46
  Bottom 0.127: U4A.22 73.66,87.43 v88.01,87.43 | v88.52,93.27 89.15,93.91 v101.35,93.91
/RAM2  (via drill 0.35)
  Top 0.127: U4B.22 55.63,86.16 55.63,86.41 56.39,87.18 60.96,87.18 v60.96,96.83
  Bottom 0.127: v60.96,96.83 61.72,97.59 90.3,97.59 91.19,98.48 97.03,98.48 98.81,96.7 100.71,96.7 U8A.48
/RESET  (via drill 0.35)
  Top 0.127: U8A.1 105.79,70.54 105.79,85.14 106.43,85.78 106.43,96.7 105.66,97.46 105.66,102.16 106.68,103.18 106.68,118.29 | 106.68,118.29 106.68,135.56 105.66,136.58 105.66,138.48 CONN1.17 | 106.68,118.29 v105.92,118.29
  Bottom 0.127: U6A.34 96.14,118.29 v105.92,118.29
/SO
  Top 0.127: U6B.16 131.06,91.49 131.06,108 129.67,109.4 127,109.4 127,130.23 120.52,136.71 120.52,137.47 119.63,138.36 112.9,138.36 112.9,140.01 112.27,140.64 110.36,140.64 110.36,138.1 CONN1.16
/TEST  (via drill 0.35)
  Top 0.127: RN1.2 59.44,6.15 59.44,5.9 60.07,5.26 64.26,5.26 64.26,9.83 64.14,9.96 v64.14,13.26 | v68.33,19.1 68.58,19.36 v68.58,24.95 | v126.11,24.69 126.11,42.09 U5B.23 127.89,43.87 127.89,48.95 127.64,49.2 127.64,62.66 U5A.23
  Bottom 0.127: v64.14,13.26 64.14,14.4 64.52,14.4 64.9,14.79 64.9,19.1 v68.33,19.1 | v68.58,24.95 69.09,25.45 77.09,25.45 77.22,25.33 78.74,25.33 79.25,25.84 124.97,25.84 v126.11,24.69
/WE  (via drill 0.35)
  Top 0.127: U8A.57 92.96,96.07 92.96,102.92 v93.47,103.43
  Bottom 0.127: U4B.29 52.96,103.05 66.8,103.05 67.69,103.94 U4A.29 92.96,103.94 v93.47,103.43
A0  (via drill 0.35)
  Top 0.127: v80.65,89.33 81.15,89.84 81.15,120.32 U6A.38 78.99,125.28 78.99,134.17 CONN1.42 | U2D.10 176.15,48.95 176.15,67.49 | U2C.10 176.15,67.49 | 176.15,87.81 U2B.10 | 176.15,67.49 176.15,87.81 | U2A.10 176.15,108.13 176.15,87.81 | v173.99,119.43 U2E.8 | v149.1,87.94 v148.08,88.95
  Bottom 0.127: U3A.3 78.11,89.33 v80.65,89.33 80.9,89.59 89.92,89.59 90.93,88.57 116.33,88.57 116.59,88.32 121.29,88.32 121.92,88.95 136.02,88.95 136.78,89.72 143.26,89.72 144.02,88.95 v148.08,88.95 | v173.99,119.43 173.99,109.02 U2A.10 | v149.1,87.94 149.86,87.18 173.74,87.18 U2B.10
A1  (via drill 0.35)
  Top 0.127: U3A.6 81.66,81.08 81.66,90.73 81.41,90.99 81.41,118.04 U6A.37 82.04,124.77 | CONN1.41 77.72,137.98 77.72,135.82 79.25,134.29 79.25,128.96 81.79,126.42 81.79,125.02 82.04,124.77 | U2D.9 171.83,48.95 171.83,67.49 | U2C.9 171.83,67.49 | 171.83,87.81 U2B.9 | 171.83,67.49 171.83,87.81 | 171.83,108.13 U2A.9 | 171.83,87.81 171.83,108.13 | U2E.7 171.83,130.23 171.83,108.13 | 82.04,124.77 82.8,125.53 v82.8,133.91 | v128.78,135.06 131.95,135.06 v131.95,132.64
  Bottom 0.127: v82.8,133.91 83.95,135.06 v128.78,135.06 | v131.95,132.64 132.21,132.39 169.67,132.39 U2E.7
A2  (via drill 0.35)
  Top 0.127: U3A.10 86.61,80.06 86.61,83.87 85.22,85.27 83.44,85.27 83.44,97.08 84.84,98.48 84.84,104.83 84.2,105.46 v84.2,116.39 | CONN1.43 75.06,138.1 v75.06,126.8 | U2D.8 171.07,48.95 171.07,67.49 | U2C.8 171.07,67.49 | 171.07,87.81 U2B.8 | 171.07,67.49 171.07,87.81 | U2A.8 171.07,108.13 171.07,87.81 | v168.91,119.05 v168.91,121.47 U2E.6 | U6A.36 88.52,122.61 v88.52,124.89
  Bottom 0.127: v84.2,116.39 87.63,119.81 87.63,120.2 | U6A.36 87.63,120.2 | v75.06,126.8 79.12,122.74 79.12,120.2 87.63,120.2 | v168.91,119.05 168.91,109.02 U2A.8 | v88.52,124.89 88.77,124.64 99.95,124.64 100.84,123.75 127,123.75 128.91,121.85 168.53,121.85 v168.91,121.47
A3  (via drill 0.35)
  Top 0.127: U3A.13 86.74,87.81 86.74,96.57 86.23,97.08 v86.23,109.66 | v89.54,110.29 90.17,110.92 v90.17,115.37 U6A.35 | CONN1.45 72.39,138.23 v72.39,129.85 | U2E.5 166.62,130.36 166.62,110.04 U2A.7 166.62,108 166.62,87.68 | U2D.7 166.62,49.08 166.62,67.36 | U2C.7 166.62,67.36 | 166.62,87.68 U2B.7 | 166.62,67.36 166.62,87.68
  Bottom 0.127: v86.23,109.66 86.87,110.29 v89.54,110.29 | v72.39,129.85 74.04,128.2 77.22,128.2 82.17,123.24 88.65,123.24 U6A.35 | v90.17,115.37 90.42,115.62 127.64,115.62 128.52,116.51 160.27,116.51 167.64,109.15 U2A.7
A4  (via drill 0.35)
  Top 0.127: U2D.6 165.99,48.95 165.99,67.49 | U2C.6 165.99,67.49 | 165.99,87.81 U2B.6 | 165.99,67.49 165.99,87.81 | 165.99,108.13 U2A.6 | 165.99,87.81 165.99,108.13 | U2E.4 165.99,128.45 165.99,108.13 | v46.74,20.25 48.51,22.02 48.51,37.52 48.77,37.77 48.77,50.85 47.37,52.25 47.37,61.9 47.5,62.03 47.5,67.36 47.37,67.49 47.37,79.56 49.02,81.21 v49.02,81.59 | v66.68,82.48 67.95,83.75 67.95,89.08 70.74,91.88 70.74,115.88 | 70.74,115.88 70.74,135.18 72.14,136.58 72.14,137.34 70.99,138.48 69.6,138.48 69.6,139.88 68.96,140.52 67.56,140.52 67.56,137.98 CONN1.48 | v121.67,132.13 121.67,120.83 v116.97,116.13 | 70.74,115.88 v76.96,115.88
  Bottom 0.127: U3B.3 44.58,20.25 v46.74,20.25 | v49.02,81.59 49.91,82.48 v66.68,82.48 | U2E.4 162.31,132.13 v121.67,132.13 | v116.97,116.13 116.71,115.88 v76.96,115.88
A5  (via drill 0.35)
  Top 0.127: U2A.5 163.45,108.13 163.45,89.59 U2B.5 163.45,87.81 163.45,80.83 162.56,79.94 U2C.5 163.45,67.49 163.45,47.17 | v161.67,113.72 161.67,130.23 U2E.3 161.29,133.4 v156.72,137.98 | v46.74,15.93 v46.74,12.37 | v162.31,32.44 164.59,34.73 164.59,46.03 163.45,47.17 | U2D.5 163.45,47.17
  Bottom 0.127: v161.67,113.72 161.67,109.02 U2A.5 | CONN1.50 67.31,135.69 128.02,135.69 130.3,137.98 v156.72,137.98 | U3B.6 44.32,12.37 v46.74,12.37 | v46.74,15.93 48.77,17.96 53.21,17.96 55.12,19.87 67.56,19.87 67.82,19.61 70.87,19.61 71.76,18.72 122.05,18.72 125.73,22.41 137.41,22.41 141.22,26.22 156.08,26.22 v162.31,32.44
A6  (via drill 0.35)
  Top 0.127: v47.24,17.2 v47.24,8.69 | v68.07,20.12 68.33,20.37 68.33,24.44 68.07,24.69 68.07,26.34 68.45,26.72 v68.45,30.66 | v156.72,35.36 157.73,36.38 157.73,45.77 U2D.4 160.91,48.95 160.91,69.27 | 160.91,69.27 U2C.4 | 160.91,87.81 160.91,69.27 | U2B.4 160.91,87.81 | 160.91,108.13 U2A.4 | 160.91,87.81 160.91,108.13 | U2E.2 160.91,128.45 160.91,108.13 | CONN1.52 69.47,130.99 v69.47,112.96
  Bottom 0.127: v47.24,8.69 U3B.10 | v47.24,17.2 50.16,20.12 v68.07,20.12 | v68.45,30.66 68.58,30.79 74.8,30.79 75.44,31.42 79.25,31.42 80.01,30.66 99.19,30.66 101.35,32.82 144.02,32.82 146.56,35.36 v156.72,35.36 | v69.47,112.96 88.77,112.96 89.66,113.85 147.45,113.85 150.75,110.54 158.5,110.54 U2A.4
A7  (via drill 0.35)
  Top 0.127: U3B.13 53.34,18.85 v53.34,32.57 | 156.46,69.4 U2C.3 | 156.46,87.68 156.46,69.4 | U2B.3 156.46,87.68 | 156.46,108 U2A.3 | 156.46,87.68 156.46,108 | U2E.1 156.46,130.36 156.46,108 | CONN1.54 59.44,138.48 57.4,138.48 57.4,139.88 59.05,141.53 129.67,141.53 129.67,137.34 127.51,135.18 v127.51,131.63 | U2D.3 156.46,49.08 156.46,69.4
  Bottom 0.127: v53.34,32.57 53.59,32.82 78.23,32.82 80.14,30.91 99.06,30.91 101.22,33.07 143,33.07 150.24,40.31 150.24,43.23 154.18,43.23 157.48,46.54 U2D.3 | v127.51,131.63 128.52,130.61 U2E.1
A8  (via drill 0.35)
  Top 0.127: U2D.25 159.13,64.19 159.13,82.73 | U2C.25 159.13,82.73 | 159.13,103.05 U2B.25 | 159.13,82.73 159.13,103.05 | U2A.25 159.13,123.37 159.13,103.05 | U2E.23 154.43,141.53 v154.43,137.47 v154.43,128.32 | U3C.3 20.95,44.88 v20.95,48.7 | v26.29,48.82 26.8,49.33 26.8,59.36 26.92,59.49 v26.92,92.13 | v66.93,93.27 70.23,93.27 70.23,132.77 67.31,135.69 67.31,139.63 66.42,140.52 63.5,140.52 CONN1.51
  Bottom 0.127: v154.43,128.32 156.84,125.91 158.37,125.91 U2A.25 | v20.95,48.7 21.08,48.82 v26.29,48.82 | v26.92,92.13 46.61,92.13 46.86,91.88 50.55,91.88 51.31,92.64 64.39,92.64 65.02,93.27 v66.93,93.27 | v154.43,137.47 130.18,137.47 128.14,135.44 66.17,135.44 64.52,137.09 64.52,139.5 CONN1.51
A9  (via drill 0.35)
  Top 0.127: U2D.24 161.67,64.19 161.67,82.73 | U2C.24 161.67,82.73 | 161.67,103.05 U2B.24 | 161.67,82.73 v161.67,96.45 161.67,103.05 | 161.67,103.05 161.67,109.91 162.18,110.42 162.18,123.88 U2A.24 162.56,140.01 164.72,142.17 164.72,147.5 162.94,147.5 U2E.22 | U3C.6 27.3,44.88 27.3,50.73 27.05,50.98 27.05,59.24 27.43,59.62 v27.43,94.29 | v69.22,95.81 69.98,96.57 69.98,132.64 67.06,135.56 67.06,138.48 CONN1.49
  Bottom 0.127: v27.43,94.29 27.81,94.67 38.23,94.67 38.61,95.05 58.93,95.05 | 58.93,95.05 59.94,96.07 68.96,96.07 v69.22,95.81 | v161.67,96.45 119.76,96.45 119.25,95.94 93.47,95.94 91.69,94.16 86.74,94.16 86.11,94.8 82.55,94.8 82.3,94.54 78.87,94.54 78.36,95.05 68.83,95.05 68.71,95.18 60.58,95.18 60.45,95.05 58.93,95.05
A10  (via drill 0.35)
  Top 0.127: U2D.21 169.29,64.19 169.29,82.73 | U2C.21 169.29,82.73 | 169.29,103.05 U2B.21 | 169.29,82.73 169.29,103.05 | 169.29,103.05 169.29,109.91 169.42,110.04 169.42,123.5 U2A.21 170.18,144.58 U2E.19 | U3C.10 31.75,53.14 31.75,62.66 33.02,63.94 v33.02,64.57 | v47.12,87.3 47.12,64.7 v46.99,64.57 v46.99,62.28 | v66.68,88.19 70.48,92 70.48,136.32 CONN1.46 | v68.2,62.03 v68.2,63.81
  Bottom 0.127: v33.02,64.57 33.27,64.82 46.74,64.82 v46.99,64.57 | v47.12,87.3 59.31,87.3 60.2,88.19 v66.68,88.19 | U2D.21 168.02,61.14 98.43,61.14 97.92,61.65 78.87,61.65 76.71,63.81 v68.2,63.81 | v68.2,62.03 67.95,62.28 54.74,62.28 53.72,61.27 52.7,61.27 52.2,61.78 47.5,61.78 v46.99,62.28
A11  (via drill 0.35)
  Top 0.127: U2D.23 164.21,64.19 164.21,82.73 | U2C.23 164.21,82.73 | 164.21,103.05 U2B.23 | 164.21,82.73 164.21,103.05 | U2A.23 164.21,123.37 164.21,111.81 | 164.21,103.05 164.21,111.81 | U3C.13 22.86,56.95 v23.11,57.2 | v18.67,58.35 18.92,58.6 18.92,70.16 18.67,70.41 v18.67,91.24 | v31.62,91.62 35.05,91.62 35.05,112.7 v36.45,114.1 | CONN1.44 73.66,132.26 v72.9,131.5 72.9,128.2 78.36,122.74 78.36,112.32 v80.65,110.04 | v163.83,111.81 164.21,111.81
  Bottom 0.127: v23.11,57.2 21.97,58.35 v18.67,58.35 | v18.67,91.24 19.05,91.62 v31.62,91.62 | v36.45,114.1 53.85,131.5 v72.9,131.5 | v163.83,111.81 163.83,106.61 138.18,106.61 135.38,109.4 110.36,109.4 109.73,110.04 94.62,110.04 93.73,109.15 81.53,109.15 v80.65,110.04
A12  (via drill 0.35)
  Top 0.127: U2D.2 155.83,48.95 155.83,67.49 | U2C.2 155.83,67.49 | 155.83,87.81 U2B.2 | 155.83,67.49 155.83,87.81 | U2A.2 155.83,108.13 155.83,87.81 | v36.83,33.58 37.08,33.84 37.08,42.09 36.83,42.34 36.83,46.66 37.46,47.3 37.46,54.79 37.34,54.92 37.34,69.02 v38.35,70.03 | v60.45,73.97 v60.45,71.68 | v88.52,76.51 88.39,76.64 88.39,85.65 89.03,86.29 v89.03,98.35 89.03,109.91 86.74,112.19 86.74,130.1 v84.33,132.51 | CONN1.47 69.34,138.74 69.34,137.59 69.98,136.96 v69.98,134.55 | v148.08,105.84 v149.35,107.11
  Bottom 0.127: U3D.3 22.1,33.33 32.38,33.33 32.89,33.84 36.58,33.84 v36.83,33.58 | v38.35,70.03 40.26,71.94 60.2,71.94 v60.45,71.68 | v60.45,73.97 60.71,73.71 70.87,73.71 71.5,74.35 81.41,74.35 81.66,74.09 86.11,74.09 v88.52,76.51 | v89.03,98.35 89.41,98.73 99.82,98.73 100.2,99.11 108.2,99.11 108.33,99.24 | U8A.41 108.33,99.24 | v69.98,134.55 72.01,132.51 v84.33,132.51 | U2A.2 153.03,107.11 v149.35,107.11 | v148.08,105.84 145.8,103.56 142.75,103.56 142.11,102.92 131.57,102.92 130.43,101.78 122.17,101.78 119.63,99.24 108.33,99.24
A13  (via drill 0.35)
  Top 0.127: v35.31,33.33 35.56,33.58 v35.56,44.63 | v37.34,45.01 37.85,45.52 v37.85,55.17 | v98.3,55.17 100.58,57.46 100.58,76.25 v104.52,80.19 | v110.49,80.7 111.76,81.97 U8A.40 112.65,98.48 112.65,100.38 112.14,100.89 112.14,112.19 v111,113.34 | CONN1.37 82.3,138.48 v82.3,125.78 | v94.87,118.16 98.81,114.23 v98.81,113.34
  Bottom 0.127: U3D.6 29.46,33.07 32.51,33.07 32.77,33.33 v35.31,33.33 | v35.56,44.63 35.94,45.01 v37.34,45.01 | v37.85,55.17 72.9,55.17 73.15,55.43 98.04,55.43 v98.3,55.17 | v104.52,80.19 105.03,80.7 v110.49,80.7 | v82.3,125.78 82.3,123.5 90.3,123.5 91.57,122.23 91.57,118.16 v94.87,118.16 | v111,113.34 v98.81,113.34
A14  (via drill 0.35)
  Top 0.127: U3D.10 31.5,40.19 31.5,47.3 v31.75,47.55 | v34.16,54.79 v34.16,47.81 | v107.44,55.43 108.08,56.06 v108.08,91.24 | v110.49,93.27 110.87,93.65 110.87,99.24 U8A.39 | CONN1.39 80.26,141.02 82.8,141.02 82.8,134.67 83.31,134.17 83.31,125.02 83.19,124.89 83.19,124.39 84.33,123.24 85.98,123.24 85.98,118.93 83.69,116.64 83.69,102.54 v84.33,101.91
  Bottom 0.127: v31.75,47.55 32,47.81 v34.16,47.81 | v34.16,54.79 34.54,55.17 37.08,55.17 37.59,55.68 43.31,55.68 43.56,55.43 72.77,55.43 73.03,55.68 107.19,55.68 v107.44,55.43 | v108.08,91.24 110.11,93.27 v110.49,93.27 | v84.33,101.91 84.84,101.4 110.49,101.4 U8A.39
A15  (via drill 0.35)
  Top 0.127: U3D.13 22.23,39.8 22.23,43.11 21.97,43.36 21.97,47.81 v22.23,48.06 | v34.67,55.68 v34.67,49.33 | v109.73,55.68 110.24,56.19 110.24,79.68 113.03,82.48 113.03,98.86 U8A.37 114.3,111.05 v113.54,111.81 | CONN1.40 77.98,137.72 77.98,138.87 77.72,139.12 77.72,139.88 79.12,141.28 85.34,141.28 85.34,135.18 87.88,132.64 87.88,126.29 89.28,124.89 v89.28,112.7
  Bottom 0.127: v22.23,48.06 22.48,48.31 27.56,48.31 28.57,49.33 v34.67,49.33 | v34.67,55.68 34.92,55.93 43.43,55.93 43.69,55.68 72.64,55.68 72.9,55.93 109.47,55.93 v109.73,55.68 | v89.28,112.7 90.17,111.81 v113.54,111.81
A16  (via drill 0.35)
  Top 0.127: U8A.36 115.95,98.48 115.95,103.05 v116.33,103.43 | v67.95,103.43 66.93,104.45 66.93,106.23 | v66.93,108.64 66.93,106.23 | CONN1.53 62.23,138.23 62.23,132.39 67.69,126.93 67.69,117.53 65.79,115.62 65.79,107.37 66.93,106.23
  Bottom 0.127: U4B.2 37.34,109.53 50.8,109.53 51.18,109.91 56.26,109.91 U4A.2 66.55,109.02 v66.93,108.64 | v116.33,103.43 116.08,103.18 106.05,103.18 105.79,103.43 104.52,103.43 103.76,102.67 92.08,102.67 91.82,102.92 68.45,102.92 v67.95,103.43
A17  (via drill 0.35)
  Top 0.127: v80.14,102.16 76.07,102.16 76.07,103.69 73.28,106.48 U4A.30 | CONN1.55 59.94,141.02 62.48,141.02 62.48,132.51 67.95,127.05 67.95,117.4 66.29,115.75 v66.29,107.62
  Bottom 0.127: U4B.30 53.21,105.34 64.01,105.34 | 64.01,105.34 71.25,105.34 U4A.30 | U8A.35 115.06,101.91 91.95,101.91 91.69,101.65 85.34,101.65 84.58,102.42 80.39,102.42 v80.14,102.16 | 64.01,105.34 v66.29,107.62
A18  (via drill 0.35)
  Top 0.127: U8A.34 118.24,98.73 v118.24,103.18 | v65.15,102.54 58.67,109.02 58.67,110.04 U4A.1 | CONN1.56 61.98,133.4 61.98,132.26 67.44,126.8 67.44,117.91 v62.36,112.83
  Bottom 0.127: U4B.1 37.85,112.58 56.13,112.58 U4A.1 61.09,111.56 v62.36,112.83 | v118.24,103.18 117.98,102.92 105.92,102.92 105.66,103.18 104.65,103.18 103.89,102.42 91.95,102.42 91.69,102.67 65.28,102.67 v65.15,102.54
A19  (via drill 0.35)
  Top 0.127: v91.44,102.16 91.31,102.29 91.31,127.44 88.65,130.1 v88.65,131.25
  Bottom 0.127: U8A.33 117.35,102.16 v91.44,102.16 | v88.65,131.25 87.88,132.01 60.83,132.01 CONN1.58
AA8  (via drill 0.35)
  Top 0.127: U5B.8 101.6,33.33 v100.46,34.47 100.46,46.92 U5A.8
  Bottom 0.127: U7B.3 58.67,41.96 62.48,41.96 63.63,40.82 63.63,38.28 75.31,38.28 79.12,34.47 v100.46,34.47
AA9  (via drill 0.35)
  Top 0.127: U7B.4 59.82,40.57 v59.82,44.63 | U5B.7 98.17,28.63 98.17,47.17 U5A.7
  Bottom 0.127: v59.82,44.63 60.96,45.77 76.2,45.77 76.84,46.41 97.41,46.41 U5A.7
AA10  (via drill 0.35)
  Top 0.127: U5A.6 95.63,47.17 95.63,40.06 v95.76,39.93 95.76,28.5 U5B.6
  Bottom 0.127: U7B.7 68.96,42.09 80.9,42.09 82.55,40.44 95.25,40.44 v95.76,39.93
AA11  (via drill 0.35)
  Top 0.127: v69.85,43.49 U7B.8 | v79.5,42.85 80.26,42.09 v80.26,41.58 | 91.69,41.08 93.09,42.47 93.09,47.17 U5A.5 | 91.69,41.08 v90.55,39.93 | U5B.5 91.69,30.03 91.69,41.08
  Bottom 0.127: v69.85,43.49 70.48,42.85 v79.5,42.85 | v80.26,41.58 81.92,39.93 v90.55,39.93
AA12  (via drill 0.35)
  Top 0.127: U7B.13 70.23,47.68 v70.23,45.01 | v77.98,45.01 77.72,44.76 77.72,36.63 v77.98,36.38 | 90.04,35.61 91.44,34.22 U5B.4 | 90.04,35.61 v89.41,36.25 | U5A.4 90.04,46.66 90.04,35.61
  Bottom 0.127: v77.98,45.01 v70.23,45.01 | v77.98,36.38 78.11,36.25 v89.41,36.25
AA13  (via drill 0.35)
  Top 0.127: U7B.14 67.95,47.42 v67.95,45.01 | v78.61,44.25 78.99,43.87 v78.99,35.61 | U5B.3 88.52,28.12 88.52,35.23 v88.01,35.74 88.01,47.17 U5A.3
  Bottom 0.127: v67.95,45.01 68.45,44.5 73.66,44.5 73.91,44.76 77.47,44.76 77.98,44.25 v78.61,44.25 | v78.99,35.61 79.12,35.74 v88.01,35.74
AA14  (via drill 0.35)
  Top 0.127: v79.5,49.58 80.77,48.31 80.77,38.53 81.53,37.77 81.53,29.14 v81.28,28.88 | U5A.2 85.47,47.17 85.47,28.63 U5B.2
  Bottom 0.127: U7B.17 61.21,49.58 v79.5,49.58 | v81.28,28.88 81.28,26.09 84.71,26.09 U5B.2
AA15  (via drill 0.35)
  Top 0.127: 85.98,50.35 87.25,49.08 87.25,43.87 U5B.39 | 85.98,50.35 v85.34,50.98 | U5A.39 85.98,62.92 85.98,50.35
  Bottom 0.127: U7B.18 59.18,50.09 84.46,50.09 v85.34,50.98
AA16  (via drill 0.35)
  Top 0.127: U7C.3 22.99,3.48 44.58,3.48 44.58,2.47 45.09,1.96 65.15,1.96 65.15,10.85 v64.77,11.23 | v77.47,28.12 81.03,31.68 v81.03,35.11 | v89.03,35.23 88.9,35.36 U5B.38 89.79,43.87 89.79,48.95 88.9,49.84 U5A.38
  Route15 0.127: v64.77,11.23 63.63,12.37 63.63,15.04 64.77,16.18 64.77,17.58 67.82,20.63 68.83,20.63 74.55,26.34 75.69,26.34 v77.47,28.12
  Bottom 0.127: v81.03,35.11 81.15,35.23 v89.03,35.23
AA17  (via drill 0.35)
  Top 0.127: U7C.4 22.86,11.99 21.46,13.39 21.46,34.09 v20.95,34.6 | v43.94,39.3 v43.94,34.85 | v45.47,44.63 v45.47,39.68 | v44.07,45.77 42.67,47.17 v42.67,49.84 | U5A.37 91.44,55.05 v89.41,53.01 92.33,50.09 92.33,43.87 U5B.37
  Bottom 0.127: v20.95,34.6 21.46,35.11 43.69,35.11 v43.94,34.85 | v43.94,39.3 44.32,39.68 v45.47,39.68 | v45.47,44.63 44.32,45.77 v44.07,45.77 | v42.67,49.84 42.93,49.58 46.48,49.58 47.88,50.98 78.23,50.98 79.38,52.12 88.52,52.12 v89.41,53.01
AA18  (via drill 0.35)
  Top 0.127: v45.97,7.42 45.72,7.67 45.72,25.58 48.01,27.87 48.01,37.52 47.75,37.77 47.75,38.79 v48.26,39.3 | v94.49,38.92 93.98,39.42 U5B.36 94.87,43.87 94.87,62.41 U5A.36
  Bottom 0.127: U7C.7 32.13,4.5 39.5,4.5 42.42,7.42 v45.97,7.42 | v48.26,39.3 51.18,42.22 62.61,42.22 63.88,40.95 63.88,38.53 79.25,38.53 79.63,38.92 v94.49,38.92
AA19  (via drill 0.35)
  Top 0.127: v12.7,6.4 11.18,7.93 11.18,27.49 9.4,29.26 9.4,32.19 9.14,32.44 9.14,40.44 9.65,40.95 v9.65,42.47 | U5A.35 96.52,53.77 v95.76,53.01 97.41,51.36 97.41,43.87 U5B.35
  Route15 0.127: v36.32,39.93 36.32,41.33 36.07,41.58 36.07,44.5 v39.37,47.81
  Bottom 0.127: U7C.8 31.24,7.93 14.22,7.93 v12.7,6.4 | v9.65,42.47 5.97,42.47 5.21,41.71 2.41,41.71 1.52,40.82 1.52,36.88 11.81,36.88 12.83,37.9 14.48,37.9 14.86,37.52 33.91,37.52 v36.32,39.93 | v39.37,47.81 40.89,49.33 46.61,49.33 48.01,50.73 78.36,50.73 79.5,51.87 94.62,51.87 v95.76,53.01
AD0  (via drill 0.35)
  Top 0.127: U4C.2 16.51,20.12 16.51,54.79 | 16.51,54.79 16.51,63.68 v17.02,64.19 | v7.75,65.84 v7.75,75.49 | U6C.11 v66.04,30.53 | U5B.16 121.92,41.2 122.81,42.09 122.81,47.17 U5A.16 121.92,50.35 123.32,51.74 123.32,82.1 124.97,83.75 124.97,93.91 v124.59,94.29 124.59,109.53 v126.49,111.43 | v16.64,54.79 16.51,54.79
  Bottom 0.127: v17.02,64.19 16.64,64.57 U7D.11 9.02,64.57 v7.75,65.84 | CONN5.16 5.59,75.49 v7.75,75.49 | U7A.3 59.44,30.03 65.53,30.03 v66.04,30.53 67.18,29.39 120.27,29.39 U5B.16 | U8A.31 120.27,94.16 124.46,94.16 v124.59,94.29 | U6B.34 143.26,111.31 130.68,111.31 130.56,111.43 v126.49,111.43 | v16.64,54.79 17.78,53.65 38.35,53.65 40.39,51.62 64.52,51.62 U6C.11
AD1  (via drill 0.35)
  Top 0.127: U5B.15 120.27,28.63 120.27,47.17 U5A.15 120.65,49.33 v120.65,56.95 120.65,93.78 U8A.30 | v141.73,108 141.73,97.84 v139.83,95.94 | U7A.4 60.07,28.12 v60.07,30.79 | v62.74,31.04 63.5,31.8 U6C.10 63.5,56.7 | U4C.3 21.21,19.74 21.21,33.33 19.18,35.36 16.76,35.36 16.76,54.16 17.15,54.54 v17.15,61.27 | v7.62,77.14 8.76,76 v8.76,62.41 | v63.5,61.52 63.5,56.7 | 63.5,56.7 v63.88,56.7
  Bottom 0.127: U6B.33 142.49,108 v141.73,108 | v139.83,95.94 122.81,95.94 U8A.30 | v60.07,30.79 60.32,31.04 v62.74,31.04 | CONN5.14 6.48,77.14 v7.62,77.14 | v8.76,62.41 9.14,62.03 U7D.12 16.38,62.03 v17.15,61.27 17.4,61.01 33.91,61.01 34.42,60.51 53.34,60.51 54.1,61.27 63.25,61.27 v63.5,61.52 | v120.65,56.95 93.73,56.95 93.22,57.46 89.41,57.46 88.9,56.95 75.44,56.95 75.18,57.2 70.48,57.2 69.98,56.7 v63.88,56.7
AD2  (via drill 0.35)
  Top 0.127: U5B.14 115.7,28.88 v115.7,55.93 115.7,65.2 117.35,66.86 118.11,66.86 | 118.11,66.86 118.11,51.49 116.84,50.22 U5A.14 | U8A.29 118.11,91.24 118.11,66.86 | v141.22,107.11 139.32,105.21 v139.32,93.14 | v7.49,59.49 6.1,60.89 6.1,61.14 4.95,62.28 4.06,62.28 4.06,80.06 CONN5.12 | U4C.4 23.49,19.48 v23.49,21.9 | v46.23,24.31 47.12,25.2 v47.12,25.33 | v66.42,24.69 67.31,25.58 U7A.7 65.53,29.52 65.53,30.79 65.66,30.91 65.66,44.25 v64.9,45.01 | v60.96,45.01 U6C.9 60.96,56.19 | 60.96,56.19 v60.96,60.25 | 60.96,56.19 v61.34,56.19
  Bottom 0.127: U6B.32 144.15,107.11 v141.22,107.11 | v139.32,93.14 139.19,93.02 130.81,93.02 130.3,93.53 120.4,93.53 U8A.29 | v7.49,59.49 U7D.13 14.48,60 21.46,60 22.23,60.76 33.78,60.76 34.29,60.25 55.12,60.25 55.88,61.01 60.2,61.01 v60.96,60.25 | v23.49,21.9 24.77,23.17 42.16,23.17 42.29,23.04 44.96,23.04 v46.23,24.31 | v47.12,25.33 47.24,25.45 65.66,25.45 v66.42,24.69 | v64.9,45.01 v60.96,45.01 | v115.7,55.93 115.44,56.19 v61.34,56.19
AD3  (via drill 0.35)
  Top 0.127: U5B.13 115.19,28.63 115.19,47.17 U5A.13 115.19,48.95 v115.19,54.16 115.19,69.14 115.82,69.78 v115.82,91.88 | U8A.28 123.57,94.16 v123.57,103.18 | U7A.8 69.34,28.25 v69.34,31.3 | v59.18,31.3 58.42,32.06 U6C.8 58.04,53.52 58.04,58.09 | U4C.5 27.05,20.5 27.05,41.58 29.21,43.74 U7D.15 | v19.18,83.62 20.45,82.35 v20.45,79.94 | v24.77,77.27 25.15,76.89 25.15,60.25 | v25.15,57.84 25.15,60.25 | v58.04,59.49 58.04,58.09 | 25.15,60.25 v25.53,60.25 | v88.39,54.28 88.01,54.66 v88.01,58.47 | 58.04,58.09 v58.8,58.09
  Bottom 0.127: v123.57,103.18 123.95,103.56 136.65,103.56 136.78,103.43 142.24,103.43 144.02,105.21 U6B.31 | v115.82,91.88 116.08,91.62 119.63,91.62 120.52,92.51 U8A.28 | v69.34,31.3 69.09,31.55 59.44,31.55 v59.18,31.3 | v19.18,83.62 CONN5.10 | v20.45,79.94 23.11,77.27 v24.77,77.27 | v25.15,57.84 26.03,56.95 U7D.15 | v58.04,59.49 57.53,60 55.63,60 55.37,59.74 30.73,59.74 30.1,60.38 25.65,60.38 v25.53,60.25 | v115.19,54.16 88.52,54.16 v88.39,54.28 | v88.01,58.47 87.25,59.24 79.63,59.24 79.38,58.98 66.42,58.98 65.41,57.97 58.93,57.97 v58.8,58.09
AD4  (via drill 0.35)
  Top 0.127: v133.1,92.51 135,94.42 v135,102.03 | U5B.12 112.65,28.63 112.65,47.17 U5A.12 111.76,50.6 v112.65,51.49 | U4C.6 26.29,17.2 24.51,17.2 24.51,23.8 26.29,25.58 26.29,48.06 25.78,48.57 25.78,50.47 26.29,50.98 26.29,58.6 v26.03,58.85 26.03,58.98 26.67,59.62 26.67,86.03 v26.16,86.54 | v55.88,59.49 U6C.7 v55.88,43.36 | U7A.13 68.71,36.5 v68.71,43.36 | U8A.27 118.49,89.08 118.49,82.1 120.4,80.19 120.4,57.46 119.38,56.44 v119.38,52.12
  Bottom 0.127: U8A.27 120.65,91.24 131.83,91.24 v133.1,92.51 | v135,102.03 135.64,102.67 U6B.30 | v26.03,58.85 26.67,59.49 U7D.16 v55.88,59.49 | v55.88,43.36 v68.71,43.36 69.34,44 70.1,44 70.36,43.74 78.87,43.74 81.28,46.16 109.86,46.16 U5A.12 | CONN5.8 5.46,86.54 v26.16,86.54 | v119.38,52.12 118.75,51.49 v112.65,51.49
AD5  (via drill 0.35)
  Top 0.127: U5B.11 108.33,28.63 v108.33,33.96 108.33,47.17 U5A.11 109.22,48.82 110.49,50.09 110.49,75.24 113.28,78.03 113.28,85.65 v114.68,87.05 | v138.05,97.84 137.03,96.83 v137.03,89.21 | U4C.7 29.59,19.74 29.59,35.87 | 29.59,35.87 29.59,55.55 30.73,56.7 30.73,60.51 U7D.17 | 29.59,35.87 v31.24,35.87 | U6C.6 53.09,52.89 v53.09,45.14 | v49.78,37.77 v49.78,45.14 | v19.18,89.21 21.34,87.05 v21.34,61.9
  Bottom 0.127: v114.68,87.05 119,87.05 U8A.25 120.78,87.43 121.92,88.57 136.4,88.57 v137.03,89.21 | U6B.29 142.49,97.84 v138.05,97.84 | 49.78,37.01 45.59,37.01 44.2,35.61 31.5,35.61 v31.24,35.87 | 49.78,37.01 65.66,37.01 U7A.14 68.83,33.84 75.18,33.84 75.57,34.22 82.8,34.22 83.06,33.96 v108.33,33.96 | v49.78,45.14 v53.09,45.14 | 49.78,37.01 v49.78,37.77 | CONN5.6 5.46,89.08 19.05,89.08 v19.18,89.21 | v21.34,61.9 21.46,62.03 U7D.17
AD6  (via drill 0.35)
  Top 0.127: U5B.10 105.79,28.63 105.79,31.3 | 105.79,31.3 105.79,47.17 U5A.10 106.05,48.7 106.05,62.16 105.41,62.79 v105.41,86.92 | v140.46,88.32 141.73,89.59 v141.73,96.95 | v40.13,16.82 39.88,17.07 v39.88,32.31 | v58.93,32.31 59.69,33.07 U7A.17 | v49.53,32.69 49.28,32.95 49.28,46.66 50.29,47.68 50.29,52.63 U6C.5 51.18,53.52 v51.18,64.32 | v16.76,91.24 18.41,89.59 v18.41,66.6 | v106.05,31.3 105.79,31.3 | v75.69,30.91 74.42,32.19 v74.42,32.31
  Bottom 0.127: v140.46,88.32 122.81,88.32 U8A.24 121.03,86.54 105.79,86.54 v105.41,86.92 | v141.73,96.95 142.37,97.59 U6B.28 | U4C.8 35.05,16.82 v40.13,16.82 | 49.53,32.31 52.83,32.31 53.09,32.06 56.64,32.06 56.9,32.31 v58.93,32.31 v74.42,32.31 | 49.53,32.31 v39.88,32.31 | 49.53,32.31 v49.53,32.69 | v51.18,64.32 48.51,64.32 47.75,65.08 29.72,65.08 U7D.18 28.19,65.59 19.43,65.59 v18.41,66.6 | v16.76,91.24 CONN5.4 | v106.05,31.3 100.2,31.3 99.31,30.41 78.11,30.41 77.6,30.91 v75.69,30.91
AD7  (via drill 0.35)
  Top 0.127: U5B.9 105.03,28.63 v105.03,30.79 105.03,47.17 U5A.9 105.03,48.95 105.03,83.87 v104.9,84 | U4C.9 35.94,19.23 v35.94,21.9 | v40.39,28.25 v40.39,22.66 | v49.02,28.25 v49.02,31.8 49.02,52.38 U6C.4 v48.26,65.33 | v57.15,31.8 U7A.18 | v26.42,94.8 25.65,94.03 v25.65,67.49 | v76.58,30.41 74.55,30.41 v74.55,31.3
  Bottom 0.127: U6B.27 150.88,95.05 150.88,90.48 146.94,86.54 129.41,86.54 128.14,85.27 122.3,85.27 U8A.22 121.03,84 v104.9,84 | v35.94,21.9 36.7,22.66 v40.39,22.66 | v49.02,28.25 v40.39,28.25 | v48.26,65.33 37.08,65.33 35.69,66.73 29.59,66.73 U7D.19 26.03,67.11 v25.65,67.49 | v49.02,31.8 v57.15,31.8 74.04,31.8 v74.55,31.3 | CONN5.2 17.65,93.78 18.67,94.8 v26.42,94.8 | v105.03,30.79 104.39,30.15 77.98,30.15 77.72,30.41 v76.58,30.41
ALE  (via drill 0.35)
  Top 0.127: v36.83,23.68 37.08,23.42 37.08,14.79 U7C.11 | U8A.81 102.49,68.76 v102.49,67.24 | v76.45,66.86 76.71,66.6 76.71,49.84 U7B.11 73.66,46.79 73.66,36.63 U7A.11 74.93,34.22 71.5,30.79 71.5,25.58 v70.61,24.69 | RN2.4 63.37,13.64 63.37,22.91 v64.01,23.55
  Bottom 0.127: U7C.11 41.78,10.09 59.82,10.09 RN2.4 | CONN5.53 2.54,26.22 2.16,26.22 1.52,25.58 1.52,23.93 12.7,23.93 12.95,23.68 v36.83,23.68 | U5C.5 136.91,61.78 113.41,61.78 113.41,64.19 114.05,64.82 114.17,64.82 114.17,66.73 113.54,67.36 102.62,67.36 v102.49,67.24 102.11,66.86 v76.45,66.86 | v64.01,23.55 64.64,24.18 70.1,24.18 v70.61,24.69
BATT  (via drill 0.35)
  Top 0.127: U10B.3 150.11,33.84 150.11,51.62 151.13,52.63 v151.13,134.42
  Bottom 0.127: v151.13,134.42 149.86,135.69 G1.+
BHE/S7  (via drill 0.35)
  Top 0.127: v81.15,25.07 86.49,25.07 86.49,19.87 87.5,18.85 99.19,18.85 99.19,26.09 99.95,26.85 99.95,42.09 U5B.34
  Bottom 0.127: RN1.9 56.77,23.04 64.64,23.04 65.53,23.93 70.74,23.93 71.63,24.82 80.9,24.82 v81.15,25.07
CLK  (via drill 0.35)
  Top 0.127: U5B.19 128.65,28.63 128.65,47.17 U5A.19 128.65,48.95 v128.65,69.52 | v43.81,46.79 44.58,46.03 v44.58,44 | v74.17,44.25 77.22,44.25 77.22,73.21 v76.96,73.46